# Altium project TM_DE_REV1.0.PrjPcb (part 1 of 2)
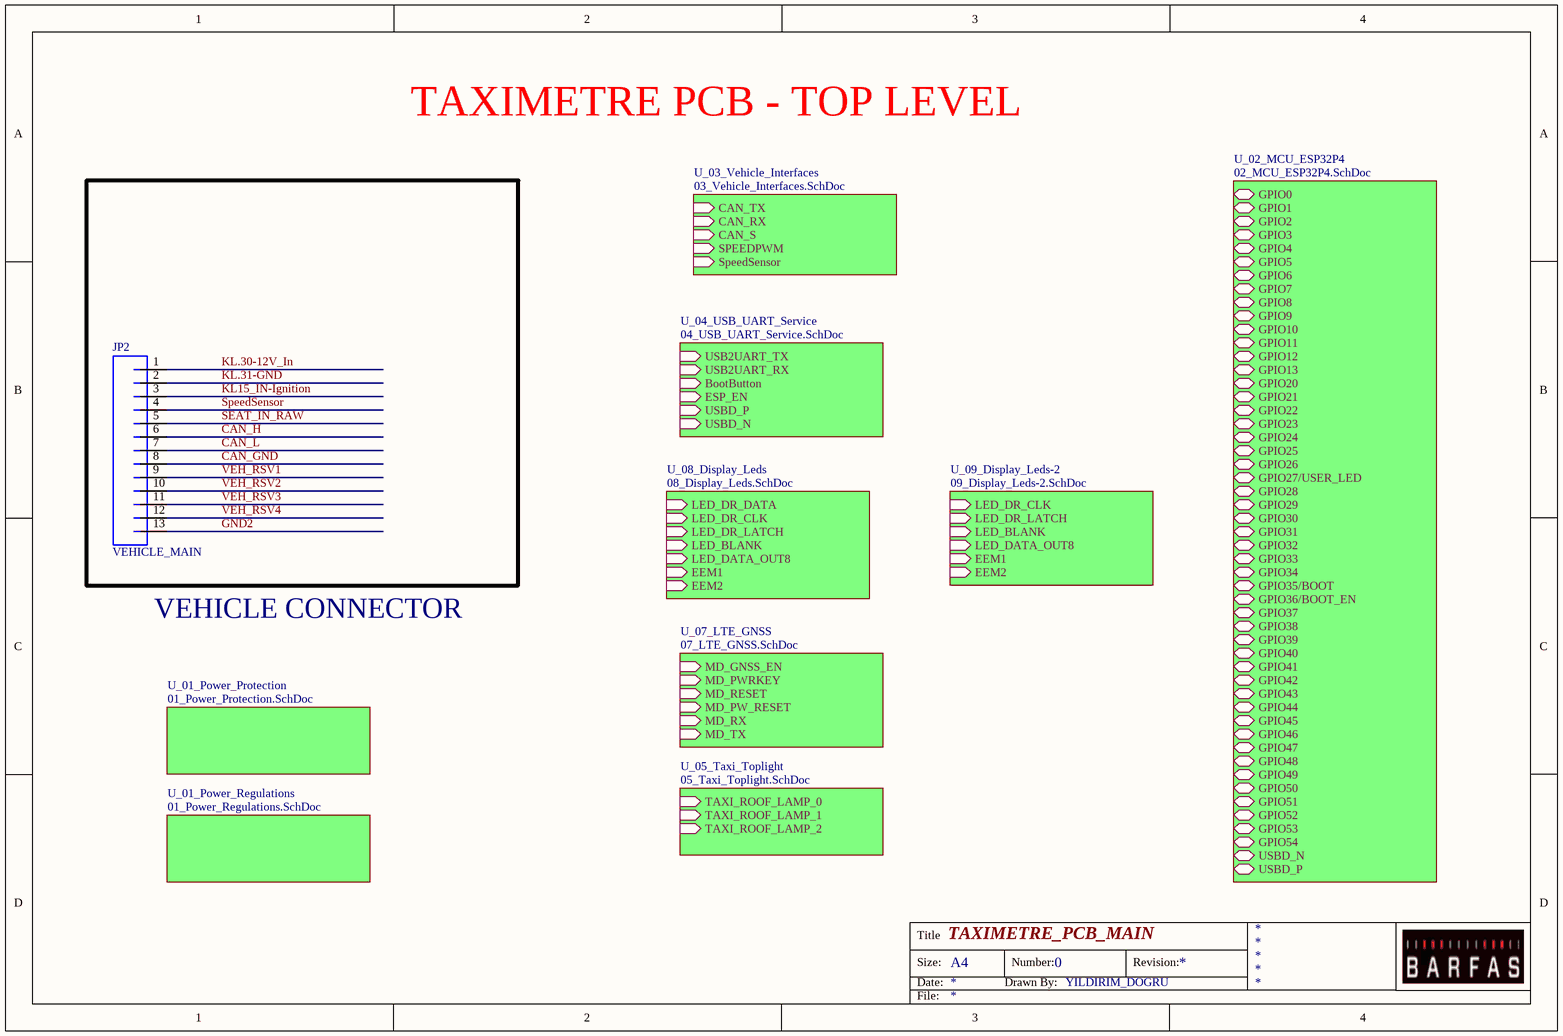
[diagram p0: TOP.SchDoc]
11 sheets, 428 parts. Net scope: hierarchical (ports join the sheet entries above them; power ports are global).
Board file: TM_DE_REV1.0.PcbDoc
Sheets:
  TOP.SchDoc
    U_08_Display_Leds = 08_Display_Leds.SchDoc
    U_09_Display_Leds-2 = 09_Display_Leds-2.SchDoc
    U_07_LTE_GNSS = 07_LTE_GNSS.SchDoc
    U_04_USB_UART_Service = 04_USB_UART_Service.SchDoc
    U_03_Vehicle_Interfaces = 03_Vehicle_Interfaces.SchDoc
    U_02_MCU_ESP32P4 = 02_MCU_ESP32P4.SchDoc
    U_01_Power_Protection = 01_Power_Protection.SchDoc
    U_01_Power_Regulations = 01_Power_Regulations.SchDoc
    U_05_Taxi_Toplight = 05_Taxi_Toplight.SchDoc
  06_RFID_RTC_Storage.SchDoc

## Sheet TOP.SchDoc: TAXIMETRE_PCB_MAIN
size A4; Author: YILDIRIM_DOGRU; CompanyName: BARFAS; DrawnBy: YILDIRIM_DOGRU; DocumentNumber: 0

### Parts
JP2  VEHICLE_MAIN  [JST-XH-13-PTH-VERT]

### Sub-sheets
U_01_Power_Protection = 01_Power_Protection.SchDoc: no entries
U_01_Power_Regulations = 01_Power_Regulations.SchDoc: no entries
U_02_MCU_ESP32P4 = 02_MCU_ESP32P4.SchDoc: GPIO0 (bidir), GPIO1 (bidir), GPIO2 (bidir), GPIO3 (bidir), GPIO4 (bidir), GPIO5 (bidir), GPIO6 (bidir), GPIO7 (bidir), GPIO8 (bidir), GPIO9 (bidir), GPIO10 (bidir), GPIO11 (bidir), GPIO12 (bidir), GPIO13 (bidir), GPIO20 (bidir), GPIO21 (bidir), GPIO22 (bidir), GPIO23 (bidir), GPIO24 (bidir), GPIO25 (bidir), GPIO26 (bidir), GPIO27/USER_LED (bidir), GPIO28 (bidir), GPIO29 (bidir), GPIO30 (bidir), GPIO31 (bidir), GPIO32 (bidir), GPIO33 (bidir), GPIO34 (bidir), GPIO35/BOOT (bidir), GPIO36/BOOT_EN (bidir), GPIO37 (bidir), GPIO38 (bidir), GPIO39 (bidir), GPIO40 (bidir), GPIO41 (bidir), GPIO42 (bidir), GPIO43 (bidir), GPIO44 (bidir), GPIO45 (bidir), GPIO46 (bidir), GPIO47 (bidir), GPIO48 (bidir), GPIO49 (bidir), GPIO50 (bidir), GPIO51 (bidir), GPIO52 (bidir), GPIO53 (bidir), GPIO54 (bidir), USBD_N (bidir), USBD_P (bidir)
U_03_Vehicle_Interfaces = 03_Vehicle_Interfaces.SchDoc: CAN_TX (in), CAN_RX (in), CAN_S (in), SPEEDPWM (in), SpeedSensor (in)
U_04_USB_UART_Service = 04_USB_UART_Service.SchDoc: USB2UART_TX (in), USB2UART_RX (in), BootButton (in), ESP_EN (in), USBD_P (in), USBD_N (in)
U_05_Taxi_Toplight = 05_Taxi_Toplight.SchDoc: TAXI_ROOF_LAMP_0 (in), TAXI_ROOF_LAMP_1 (in), TAXI_ROOF_LAMP_2 (in)
U_07_LTE_GNSS = 07_LTE_GNSS.SchDoc: MD_GNSS_EN (in), MD_PWRKEY (in), MD_RESET (in), MD_PW_RESET (in), MD_RX (in), MD_TX (in)
U_08_Display_Leds = 08_Display_Leds.SchDoc: LED_DR_DATA (in), LED_DR_CLK (in), LED_DR_LATCH (in), LED_BLANK (in), LED_DATA_OUT8 (in), EEM1 (in), EEM2 (in)
U_09_Display_Leds-2 = 09_Display_Leds-2.SchDoc: LED_DR_CLK (in), LED_DR_LATCH (in), LED_BLANK (in), LED_DATA_OUT8 (in), EEM1 (in), EEM2 (in)

### Nets
CAN_GND: JP2.8
CAN_H: JP2.6
CAN_L: JP2.7
GND2: JP2.13
KL15_IN-Ignition: JP2.3
KL.30-12V_In: JP2.1
KL.31-GND: JP2.2
SEAT_IN_RAW: JP2.5
SpeedSensor: JP2.4
VEH_RSV1: JP2.9
VEH_RSV2: JP2.10
VEH_RSV3: JP2.11
VEH_RSV4: JP2.12

### Notes on the sheet
- TAXIMETRE PCB - TOP LEVEL
- VEHICLE CONNECTOR
- Title
- Size:
- Date:
- A4
- Drawn By:
- Number:
- Revision:
- File:

### Library data of the parts
JP2 = JST_XH_13_VERT: Manufacturer: JST Sales America, Inc.; PartNumber: B13B-XH-A(LF)(SN); Mounting Technology: Through Hole; PackageReference: JST-XH

## Sheet 08_Display_Leds.SchDoc
size 558 x 431 mm
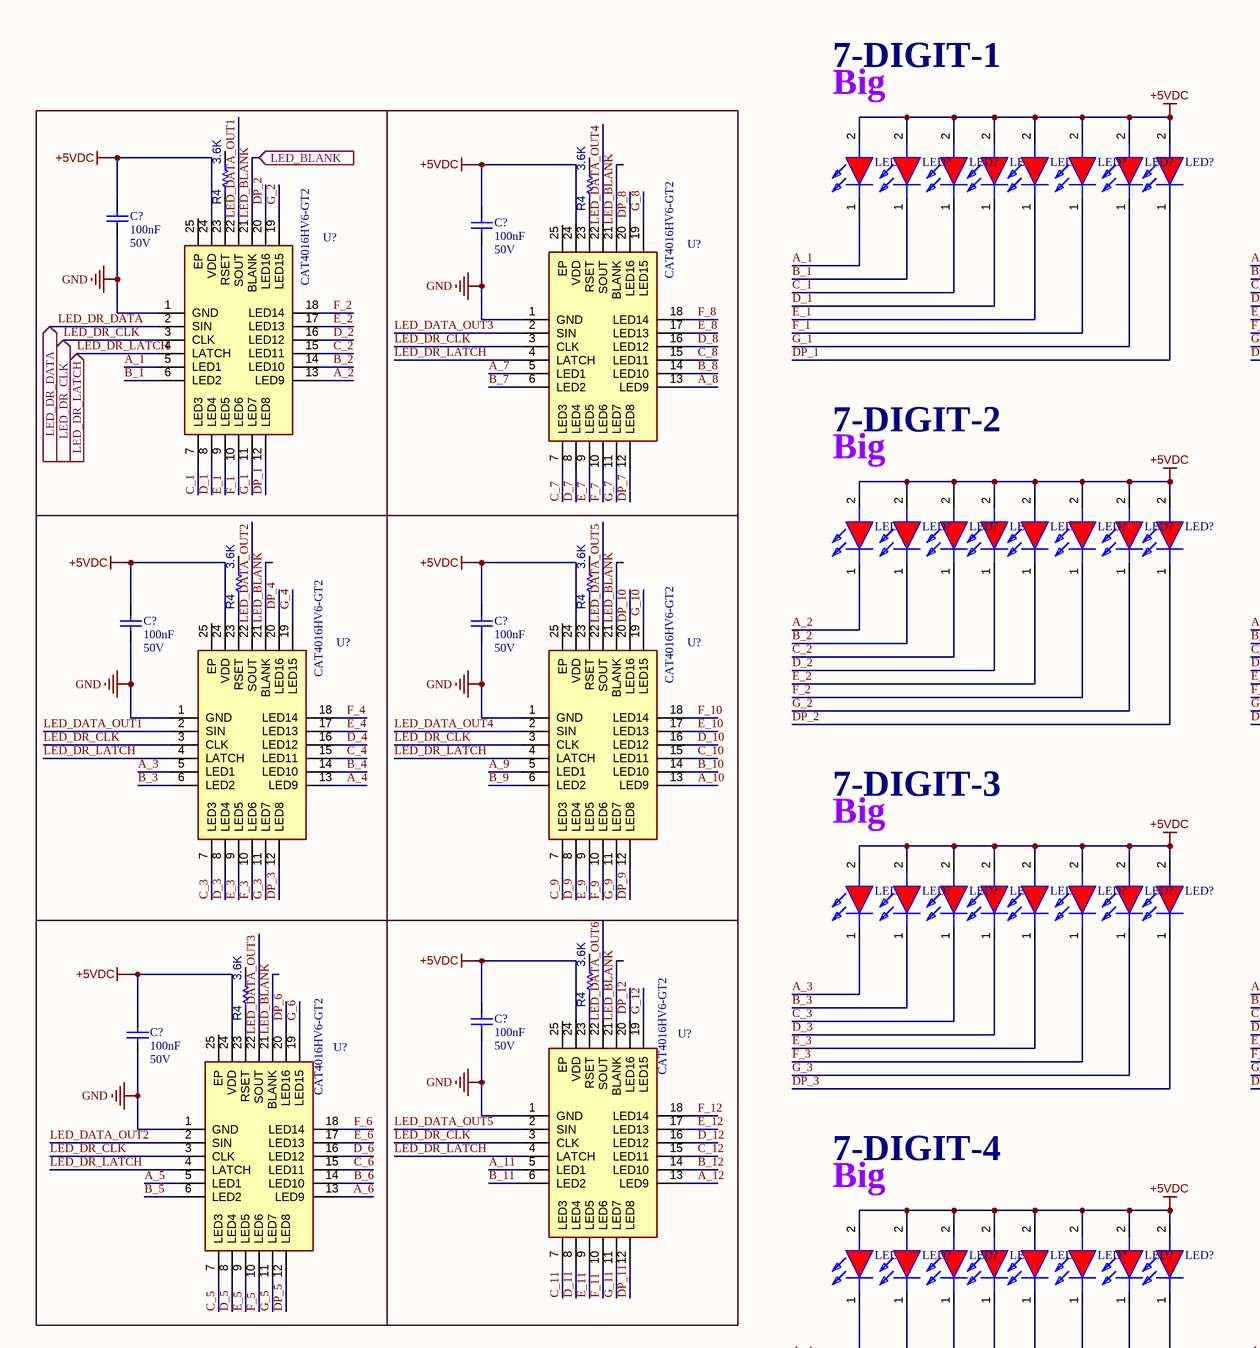
[diagram p1: 08_Display_Leds.SchDoc, top left]
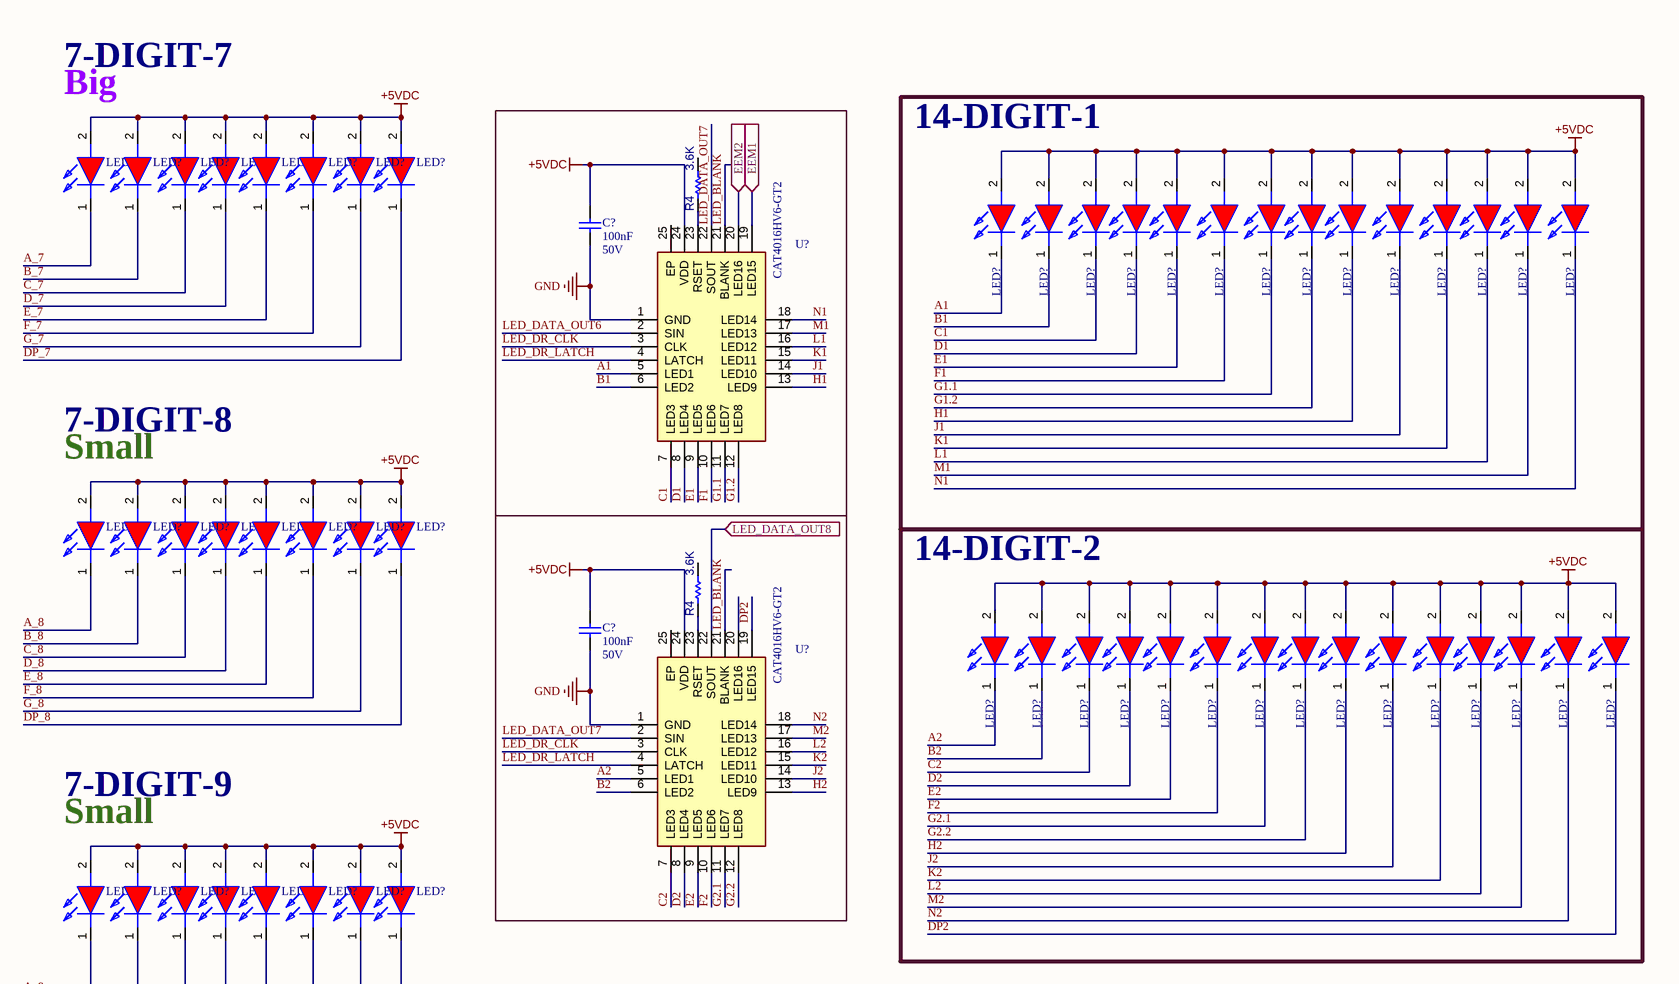
[diagram p2: 08_Display_Leds.SchDoc, top right]
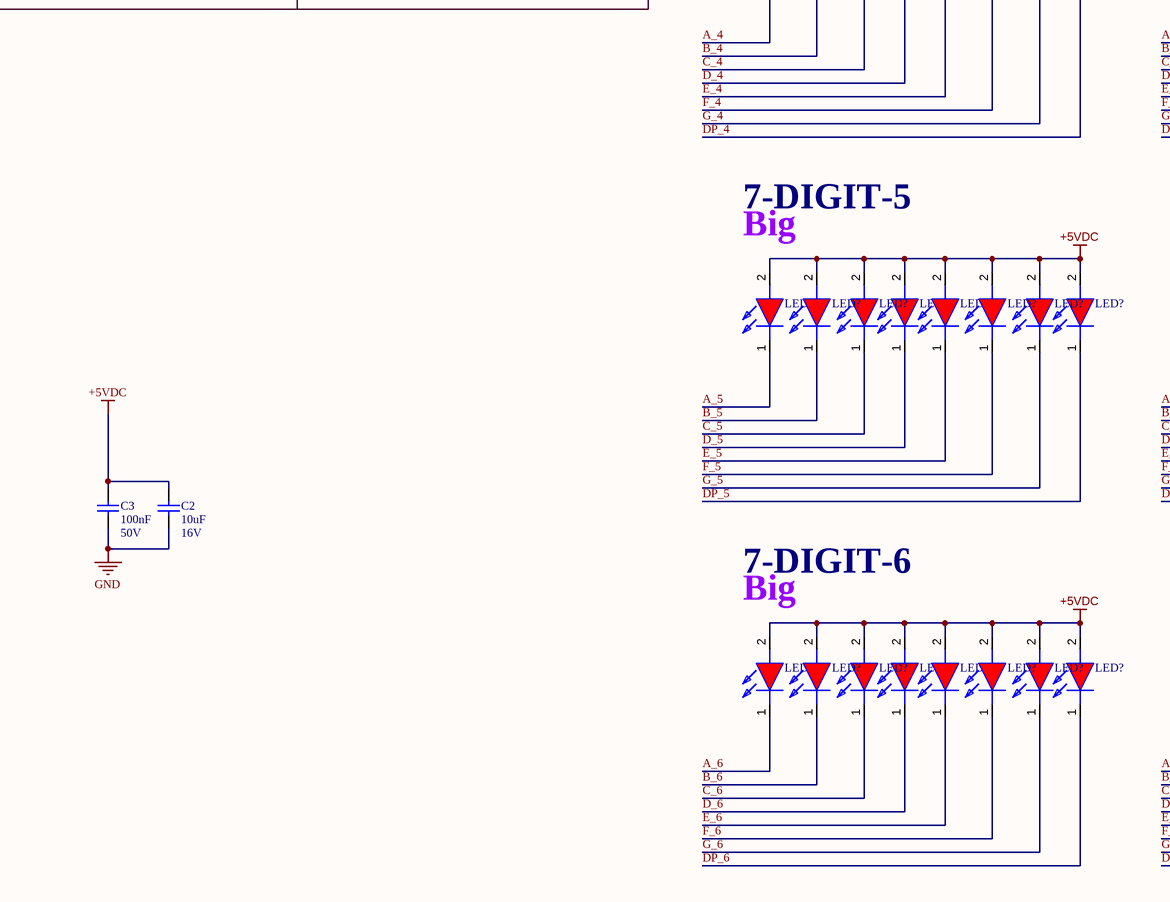
[diagram p3: 08_Display_Leds.SchDoc, bottom left]
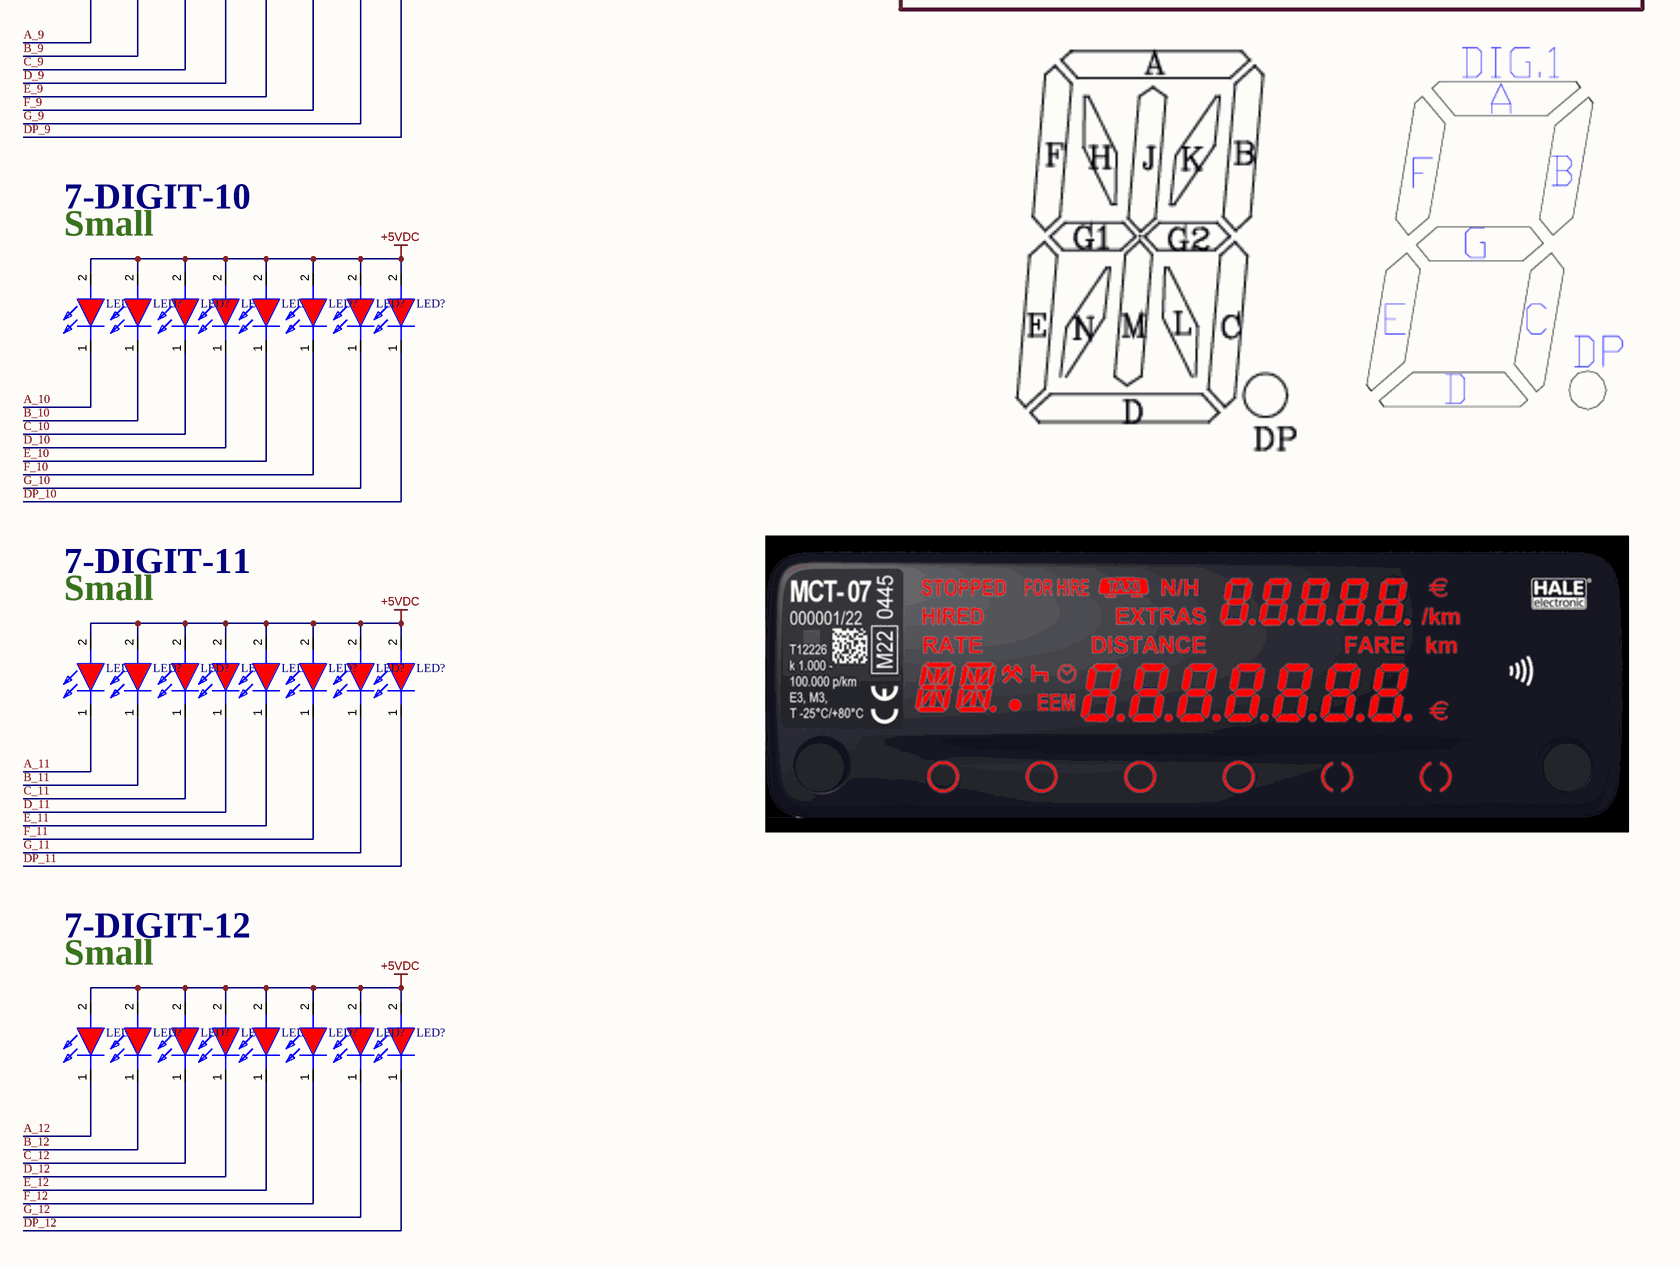
[diagram p4: 08_Display_Leds.SchDoc, bottom right]

### Parts
(Parts that share a designator on the sheet are numbered #1, #2 ... from top to bottom, then left to right.)
C2#1  value 10uF  Voltage: 16V  [CAP_0805]  (hidden comment: CAP)
C3#1  value 100nF  Voltage: 50V  [CAP_0603]  (hidden comment: CAP)
C?#1  value 100nF  Voltage: 50V  [CAP_0603]  (hidden comment: CAP)
C?#2  value 100nF  Voltage: 50V  [CAP_0603]  (hidden comment: CAP)
C?#3  value 100nF  Voltage: 50V  [CAP_0603]  (hidden comment: CAP)
C?#4  value 100nF  Voltage: 50V  [CAP_0603]  (hidden comment: CAP)
C?#5  value 100nF  Voltage: 50V  [CAP_0603]  (hidden comment: CAP)
C?#6  value 100nF  Voltage: 50V  [CAP_0603]  (hidden comment: CAP)
C?#7  value 100nF  Voltage: 50V  [CAP_0603]  (hidden comment: CAP)
C?#8  value 100nF  Voltage: 50V  [CAP_0603]  (hidden comment: CAP)
LED?#1  YLED0402R  [APHHS1005LSECKJ3PF]  (value not drawn)
LED?#2  YLED0402R  [APHHS1005LSECKJ3PF]  (value not drawn)
LED?#3  YLED0402R  [APHHS1005LSECKJ3PF]  (value not drawn)
LED?#4  YLED0402R  [APHHS1005LSECKJ3PF]  (value not drawn)
LED?#5  YLED0402R  [APHHS1005LSECKJ3PF]  (value not drawn)
LED?#6  YLED0402R  [APHHS1005LSECKJ3PF]  (value not drawn)
LED?#7  YLED0402R  [APHHS1005LSECKJ3PF]  (value not drawn)
LED?#8  YLED0402R  [APHHS1005LSECKJ3PF]  (value not drawn)
LED?#9  YLED0402R  [APHHS1005LSECKJ3PF]  (value not drawn)
LED?#10  YLED0402R  [APHHS1005LSECKJ3PF]  (value not drawn)
LED?#11  YLED0402R  [APHHS1005LSECKJ3PF]  (value not drawn)
LED?#12  YLED0402R  [APHHS1005LSECKJ3PF]  (value not drawn)
LED?#13  YLED0402R  [APHHS1005LSECKJ3PF]  (value not drawn)
LED?#14  YLED0402R  [APHHS1005LSECKJ3PF]  (value not drawn)
LED?#15  YLED0402R  [APHHS1005LSECKJ3PF]  (value not drawn)
LED?#16  YLED0402R  [APHHS1005LSECKJ3PF]  (value not drawn)
LED?#17  YLED0402R  [APHHS1005LSECKJ3PF]  (value not drawn)
LED?#18  YLED0402R  [APHHS1005LSECKJ3PF]  (value not drawn)
LED?#19  YLED0402R  [APHHS1005LSECKJ3PF]  (value not drawn)
LED?#20  YLED0402R  [APHHS1005LSECKJ3PF]  (value not drawn)
LED?#21  YLED0402R  [APHHS1005LSECKJ3PF]  (value not drawn)
LED?#22  YLED0402R  [APHHS1005LSECKJ3PF]  (value not drawn)
LED?#23  YLED0402R  [APHHS1005LSECKJ3PF]  (value not drawn)
LED?#24  YLED0402R  [APHHS1005LSECKJ3PF]  (value not drawn)
LED?#25  YLED0402R  [APHHS1005LSECKJ3PF]  (value not drawn)
LED?#26  YLED0402R  [APHHS1005LSECKJ3PF]  (value not drawn)
LED?#27  YLED0402R  [APHHS1005LSECKJ3PF]  (value not drawn)
LED?#28  YLED0402R  [APHHS1005LSECKJ3PF]  (value not drawn)
LED?#29  YLED0402R  [APHHS1005LSECKJ3PF]  (value not drawn)
LED?#30  YLED0402R  [APHHS1005LSECKJ3PF]  (value not drawn)
LED?#31  YLED0402R  [APHHS1005LSECKJ3PF]  (value not drawn)
LED?#32  YLED0402R  [APHHS1005LSECKJ3PF]  (value not drawn)
LED?#33  YLED0402R  [APHHS1005LSECKJ3PF]  (value not drawn)
LED?#34  YLED0402R  [APHHS1005LSECKJ3PF]  (value not drawn)
LED?#35  YLED0402R  [APHHS1005LSECKJ3PF]  (value not drawn)
LED?#36  YLED0402R  [APHHS1005LSECKJ3PF]  (value not drawn)
LED?#37  YLED0402R  [APHHS1005LSECKJ3PF]  (value not drawn)
LED?#38  YLED0402R  [APHHS1005LSECKJ3PF]  (value not drawn)
LED?#39  YLED0402R  [APHHS1005LSECKJ3PF]  (value not drawn)
LED?#40  YLED0402R  [APHHS1005LSECKJ3PF]  (value not drawn)
LED?#41  YLED0402R  [APHHS1005LSECKJ3PF]  (value not drawn)
LED?#42  YLED0402R  [APHHS1005LSECKJ3PF]  (value not drawn)
LED?#43  YLED0402R  [APHHS1005LSECKJ3PF]  (value not drawn)
LED?#44  YLED0402R  [APHHS1005LSECKJ3PF]  (value not drawn)
LED?#45  YLED0402R  [APHHS1005LSECKJ3PF]  (value not drawn)
LED?#46  YLED0402R  [APHHS1005LSECKJ3PF]  (value not drawn)
LED?#47  YLED0402R  [APHHS1005LSECKJ3PF]  (value not drawn)
LED?#48  YLED0402R  [APHHS1005LSECKJ3PF]  (value not drawn)
LED?#49  YLED0402R  [APHHS1005LSECKJ3PF]  (value not drawn)
LED?#50  YLED0402R  [APHHS1005LSECKJ3PF]  (value not drawn)
LED?#51  YLED0402R  [APHHS1005LSECKJ3PF]  (value not drawn)
LED?#52  YLED0402R  [APHHS1005LSECKJ3PF]  (value not drawn)
LED?#53  YLED0402R  [APHHS1005LSECKJ3PF]  (value not drawn)
LED?#54  YLED0402R  [APHHS1005LSECKJ3PF]  (value not drawn)
LED?#55  YLED0402R  [APHHS1005LSECKJ3PF]  (value not drawn)
LED?#56  YLED0402R  [APHHS1005LSECKJ3PF]  (value not drawn)
LED?#57  YLED0402R  [APHHS1005LSECKJ3PF]  (value not drawn)
LED?#58  YLED0402R  [APHHS1005LSECKJ3PF]  (value not drawn)
LED?#59  YLED0402R  [APHHS1005LSECKJ3PF]  (value not drawn)
LED?#60  YLED0402R  [APHHS1005LSECKJ3PF]  (value not drawn)
LED?#61  YLED0402R  [APHHS1005LSECKJ3PF]  (value not drawn)
LED?#62  YLED0402R  [APHHS1005LSECKJ3PF]  (value not drawn)
LED?#63  YLED0402R  [APHHS1005LSECKJ3PF]  (value not drawn)
LED?#64  YLED0402R  [APHHS1005LSECKJ3PF]  (value not drawn)
LED?#65  YLED0402R  [APHHS1005LSECKJ3PF]  (value not drawn)
LED?#66  YLED0402R  [APHHS1005LSECKJ3PF]  (value not drawn)
LED?#67  YLED0402R  [APHHS1005LSECKJ3PF]  (value not drawn)
LED?#68  YLED0402R  [APHHS1005LSECKJ3PF]  (value not drawn)
LED?#69  YLED0402R  [APHHS1005LSECKJ3PF]  (value not drawn)
LED?#70  YLED0402R  [APHHS1005LSECKJ3PF]  (value not drawn)
LED?#71  YLED0402R  [APHHS1005LSECKJ3PF]  (value not drawn)
LED?#72  YLED0402R  [APHHS1005LSECKJ3PF]  (value not drawn)
LED?#73  YLED0402R  [APHHS1005LSECKJ3PF]  (value not drawn)
LED?#74  YLED0402R  [APHHS1005LSECKJ3PF]  (value not drawn)
LED?#75  YLED0402R  [APHHS1005LSECKJ3PF]  (value not drawn)
LED?#76  YLED0402R  [APHHS1005LSECKJ3PF]  (value not drawn)
LED?#77  YLED0402R  [APHHS1005LSECKJ3PF]  (value not drawn)
LED?#78  YLED0402R  [APHHS1005LSECKJ3PF]  (value not drawn)
LED?#79  YLED0402R  [APHHS1005LSECKJ3PF]  (value not drawn)
LED?#80  YLED0402R  [APHHS1005LSECKJ3PF]  (value not drawn)
LED?#81  YLED0402R  [APHHS1005LSECKJ3PF]  (value not drawn)
LED?#82  YLED0402R  [APHHS1005LSECKJ3PF]  (value not drawn)
LED?#83  YLED0402R  [APHHS1005LSECKJ3PF]  (value not drawn)
LED?#84  YLED0402R  [APHHS1005LSECKJ3PF]  (value not drawn)
LED?#85  YLED0402R  [APHHS1005LSECKJ3PF]  (value not drawn)
LED?#86  YLED0402R  [APHHS1005LSECKJ3PF]  (value not drawn)
LED?#87  YLED0402R  [APHHS1005LSECKJ3PF]  (value not drawn)
LED?#88  YLED0402R  [APHHS1005LSECKJ3PF]  (value not drawn)
LED?#89  YLED0402R  [APHHS1005LSECKJ3PF]  (value not drawn)
LED?#90  YLED0402R  [APHHS1005LSECKJ3PF]  (value not drawn)
LED?#91  YLED0402R  [APHHS1005LSECKJ3PF]  (value not drawn)
LED?#92  YLED0402R  [APHHS1005LSECKJ3PF]  (value not drawn)
LED?#93  YLED0402R  [APHHS1005LSECKJ3PF]  (value not drawn)
LED?#94  YLED0402R  [APHHS1005LSECKJ3PF]  (value not drawn)
LED?#95  YLED0402R  [APHHS1005LSECKJ3PF]  (value not drawn)
LED?#96  YLED0402R  [APHHS1005LSECKJ3PF]  (value not drawn)
LED?#97  YLED0402R  [APHHS1005LSECKJ3PF]  (value not drawn)
LED?#98  YLED0402R  [APHHS1005LSECKJ3PF]  (value not drawn)
LED?#99  YLED0402R  [APHHS1005LSECKJ3PF]  (value not drawn)
LED?#100  YLED0402R  [APHHS1005LSECKJ3PF]  (value not drawn)
LED?#101  YLED0402R  [APHHS1005LSECKJ3PF]  (value not drawn)
LED?#102  YLED0402R  [APHHS1005LSECKJ3PF]  (value not drawn)
LED?#103  YLED0402R  [APHHS1005LSECKJ3PF]  (value not drawn)
LED?#104  YLED0402R  [APHHS1005LSECKJ3PF]  (value not drawn)
LED?#105  YLED0402R  [APHHS1005LSECKJ3PF]  (value not drawn)
LED?#106  YLED0402R  [APHHS1005LSECKJ3PF]  (value not drawn)
LED?#107  YLED0402R  [APHHS1005LSECKJ3PF]  (value not drawn)
LED?#108  YLED0402R  [APHHS1005LSECKJ3PF]  (value not drawn)
LED?#109  YLED0402R  [APHHS1005LSECKJ3PF]  (value not drawn)
LED?#110  YLED0402R  [APHHS1005LSECKJ3PF]  (value not drawn)
LED?#111  YLED0402R  [APHHS1005LSECKJ3PF]  (value not drawn)
LED?#112  YLED0402R  [APHHS1005LSECKJ3PF]  (value not drawn)
LED?#113  YLED0402R  [APHHS1005LSECKJ3PF]  (value not drawn)
LED?#114  YLED0402R  [APHHS1005LSECKJ3PF]  (value not drawn)
LED?#115  YLED0402R  [APHHS1005LSECKJ3PF]  (value not drawn)
LED?#116  YLED0402R  [APHHS1005LSECKJ3PF]  (value not drawn)
LED?#117  YLED0402R  [APHHS1005LSECKJ3PF]  (value not drawn)
LED?#118  YLED0402R  [APHHS1005LSECKJ3PF]  (value not drawn)
LED?#119  YLED0402R  [APHHS1005LSECKJ3PF]  (value not drawn)
LED?#120  YLED0402R  [APHHS1005LSECKJ3PF]  (value not drawn)
LED?#121  YLED0402R  [APHHS1005LSECKJ3PF]  (value not drawn)
LED?#122  YLED0402R  [APHHS1005LSECKJ3PF]  (value not drawn)
LED?#123  YLED0402R  [APHHS1005LSECKJ3PF]  (value not drawn)
LED?#124  YLED0402R  [APHHS1005LSECKJ3PF]  (value not drawn)
LED?#125  YLED0402R  [APHHS1005LSECKJ3PF]  (value not drawn)
R4#1  value 3.6K  [RES_0603]  (hidden comment: RC0603FR-133K6L)
R4#2  value 3.6K  [RES_0603]  (hidden comment: RC0603FR-133K6L)
R4#3  value 3.6K  [RES_0603]  (hidden comment: RC0603FR-133K6L)
R4#4  value 3.6K  [RES_0603]  (hidden comment: RC0603FR-133K6L)
R4#5  value 3.6K  [RES_0603]  (hidden comment: RC0603FR-133K6L)
R4#6  value 3.6K  [RES_0603]  (hidden comment: RC0603FR-133K6L)
R4#7  value 3.6K  [RES_0603]  (hidden comment: RC0603FR-133K6L)
R4#8  value 3.6K  [RES_0603]  (hidden comment: RC0603FR-133K6L)
U?#1  CAT4016HV6-GT2  [QFN50P400X400X80-25N-D]
U?#2  CAT4016HV6-GT2  [QFN50P400X400X80-25N-D]
U?#3  CAT4016HV6-GT2  [QFN50P400X400X80-25N-D]
U?#4  CAT4016HV6-GT2  [QFN50P400X400X80-25N-D]
U?#5  CAT4016HV6-GT2  [QFN50P400X400X80-25N-D]
U?#6  CAT4016HV6-GT2  [QFN50P400X400X80-25N-D]
U?#7  CAT4016HV6-GT2  [QFN50P400X400X80-25N-D]
U?#8  CAT4016HV6-GT2  [QFN50P400X400X80-25N-D]

### Blocks framed on the sheet
14-DIGIT-1: LED?#17-LED?#30
14-DIGIT-2: LED?#47-LED?#61

### Ports
EEM1 (in), EEM2 (in), LED_BLANK (in), LED_DATA_OUT8 (in), LED_DR_CLK (in), LED_DR_DATA (in), LED_DR_LATCH (in)

### Nets
+5VDC: C2#1.1 C3#1.1 C?#1.1 C?#2.1 C?#3.1 C?#4.1 C?#5.1 C?#6.1 C?#7.1 C?#8.1 LED?#1.2(A) LED?#2.2(A) LED?#3.2(A) LED?#4.2(A) LED?#5.2(A) LED?#6.2(A) LED?#7.2(A) LED?#8.2(A) LED?#9.2(A) LED?#10.2(A) LED?#11.2(A) LED?#12.2(A) LED?#13.2(A) LED?#14.2(A) LED?#15.2(A) LED?#16.2(A) LED?#17.2(A) LED?#18.2(A) LED?#19.2(A) LED?#20.2(A) LED?#21.2(A) LED?#22.2(A) LED?#23.2(A) LED?#24.2(A) LED?#25.2(A) LED?#26.2(A) LED?#27.2(A) LED?#28.2(A) LED?#29.2(A) LED?#30.2(A) LED?#31.2(A) LED?#32.2(A) LED?#33.2(A) LED?#34.2(A) LED?#35.2(A) LED?#36.2(A) LED?#37.2(A) LED?#38.2(A) LED?#39.2(A) LED?#40.2(A) LED?#41.2(A) LED?#42.2(A) LED?#43.2(A) LED?#44.2(A) LED?#45.2(A) LED?#46.2(A) LED?#47.2(A) LED?#48.2(A) LED?#49.2(A) LED?#50.2(A) LED?#51.2(A) LED?#52.2(A) LED?#53.2(A) LED?#54.2(A) LED?#55.2(A) LED?#56.2(A) LED?#57.2(A) LED?#58.2(A) LED?#59.2(A) LED?#60.2(A) LED?#61.2(A) LED?#62.2(A) LED?#63.2(A) LED?#64.2(A) LED?#65.2(A) LED?#66.2(A) LED?#67.2(A) LED?#68.2(A) LED?#69.2(A) LED?#70.2(A) LED?#71.2(A) LED?#72.2(A) LED?#73.2(A) LED?#74.2(A) LED?#75.2(A) LED?#76.2(A) LED?#77.2(A) LED?#78.2(A) LED?#79.2(A) LED?#80.2(A) LED?#81.2(A) LED?#82.2(A) LED?#83.2(A) LED?#84.2(A) LED?#85.2(A) LED?#86.2(A) LED?#87.2(A) LED?#88.2(A) LED?#89.2(A) LED?#90.2(A) LED?#91.2(A) LED?#92.2(A) LED?#93.2(A) LED?#94.2(A) LED?#95.2(A) LED?#96.2(A) LED?#97.2(A) LED?#98.2(A) LED?#99.2(A) LED?#100.2(A) LED?#101.2(A) LED?#102.2(A) LED?#103.2(A) LED?#104.2(A) LED?#105.2(A) LED?#106.2(A) LED?#107.2(A) LED?#108.2(A) LED?#109.2(A) LED?#110.2(A) LED?#111.2(A) LED?#112.2(A) LED?#113.2(A) LED?#114.2(A) LED?#115.2(A) LED?#116.2(A) LED?#117.2(A) LED?#118.2(A) LED?#119.2(A) LED?#120.2(A) LED?#121.2(A) LED?#122.2(A) LED?#123.2(A) LED?#124.2(A) LED?#125.2(A) U?#1.24(VDD) U?#2.24(VDD) U?#3.24(VDD) U?#4.24(VDD) U?#5.24(VDD) U?#6.24(VDD) U?#7.24(VDD) U?#8.24(VDD)
GND: C2#1.2 C3#1.2 C?#1.2 C?#2.2 C?#3.2 C?#4.2 C?#5.2 C?#6.2 C?#7.2 C?#8.2 U?#1.1(GND) U?#2.1(GND) U?#3.1(GND) U?#4.1(GND) U?#5.1(GND) U?#6.1(GND) U?#7.1(GND) U?#8.1(GND)  [project net TVSS]
A1: LED?#17.1(K) U?#3.5(LED1)
A2: LED?#47.1(K) U?#6.5(LED1)
A_1: LED?#1.1(K) U?#1.5(LED1)
A_2: LED?#31.1(K) U?#1.13(LED9)
A_3: LED?#62.1(K) U?#4.5(LED1)
A_4: LED?#78.1(K) U?#4.13(LED9)
A_5: LED?#94.1(K) U?#8.5(LED1)
A_6: LED?#110.1(K) U?#8.13(LED9)
A_7: LED?#9.1(K) U?#2.5(LED1)
A_8: LED?#39.1(K) U?#2.13(LED9)
A_9: LED?#70.1(K) U?#5.5(LED1)
A_10: LED?#86.1(K) U?#5.13(LED9)
A_11: LED?#102.1(K) U?#7.5(LED1)
A_12: LED?#118.1(K) U?#7.13(LED9)
B1: LED?#18.1(K) U?#3.6(LED2)
B2: LED?#48.1(K) U?#6.6(LED2)
B_1: LED?#2.1(K) U?#1.6(LED2)
B_2: LED?#32.1(K) U?#1.14(LED10)
B_3: LED?#63.1(K) U?#4.6(LED2)
B_4: LED?#79.1(K) U?#4.14(LED10)
B_5: LED?#95.1(K) U?#8.6(LED2)
B_6: LED?#111.1(K) U?#8.14(LED10)
B_7: LED?#10.1(K) U?#2.6(LED2)
B_8: LED?#40.1(K) U?#2.14(LED10)
B_9: LED?#71.1(K) U?#5.6(LED2)
B_10: LED?#87.1(K) U?#5.14(LED10)
B_11: LED?#103.1(K) U?#7.6(LED2)
B_12: LED?#119.1(K) U?#7.14(LED10)
C1: LED?#19.1(K) U?#3.7(LED3)
C2: LED?#49.1(K) U?#6.7(LED3)
C_1: LED?#3.1(K) U?#1.7(LED3)
C_2: LED?#33.1(K) U?#1.15(LED11)
C_3: LED?#64.1(K) U?#4.7(LED3)
C_4: LED?#80.1(K) U?#4.15(LED11)
C_5: LED?#96.1(K) U?#8.7(LED3)
C_6: LED?#112.1(K) U?#8.15(LED11)
C_7: LED?#11.1(K) U?#2.7(LED3)
C_8: LED?#41.1(K) U?#2.15(LED11)
C_9: LED?#72.1(K) U?#5.7(LED3)
C_10: LED?#88.1(K) U?#5.15(LED11)
C_11: LED?#104.1(K) U?#7.7(LED3)
C_12: LED?#120.1(K) U?#7.15(LED11)
D1: LED?#20.1(K) U?#3.8(LED4)
D2: LED?#50.1(K) U?#6.8(LED4)
D_1: LED?#4.1(K) U?#1.8(LED4)
D_2: LED?#34.1(K) U?#1.16(LED12)
D_3: LED?#65.1(K) U?#4.8(LED4)
D_4: LED?#81.1(K) U?#4.16(LED12)
D_5: LED?#97.1(K) U?#8.8(LED4)
D_6: LED?#113.1(K) U?#8.16(LED12)
D_7: LED?#12.1(K) U?#2.8(LED4)
D_8: LED?#42.1(K) U?#2.16(LED12)
D_9: LED?#73.1(K) U?#5.8(LED4)
D_10: LED?#89.1(K) U?#5.16(LED12)
D_11: LED?#105.1(K) U?#7.8(LED4)
D_12: LED?#121.1(K) U?#7.16(LED12)
DP2: LED?#61.1(K) U?#6.19(LED15)
DP_1: LED?#8.1(K) U?#1.12(LED8)
DP_2: LED?#38.1(K) U?#1.20(LED16)
DP_3: LED?#69.1(K) U?#4.12(LED8)
DP_4: LED?#85.1(K) U?#4.20(LED16)
DP_5: LED?#101.1(K) U?#8.12(LED8)
DP_6: LED?#117.1(K) U?#8.20(LED16)
DP_7: LED?#16.1(K) U?#2.12(LED8)
DP_8: LED?#46.1(K) U?#2.20(LED16)
DP_9: LED?#77.1(K) U?#5.12(LED8)
DP_10: LED?#93.1(K) U?#5.20(LED16)
DP_11: LED?#109.1(K) U?#7.12(LED8)
DP_12: LED?#125.1(K) U?#7.20(LED16)
E1: LED?#21.1(K) U?#3.9(LED5)
E2: LED?#51.1(K) U?#6.9(LED5)
E_1: LED?#5.1(K) U?#1.9(LED5)
E_2: LED?#35.1(K) U?#1.17(LED13)
E_3: LED?#66.1(K) U?#4.9(LED5)
E_4: LED?#82.1(K) U?#4.17(LED13)
E_5: LED?#98.1(K) U?#8.9(LED5)
E_6: LED?#114.1(K) U?#8.17(LED13)
E_7: LED?#13.1(K) U?#2.9(LED5)
E_8: LED?#43.1(K) U?#2.17(LED13)
E_9: LED?#74.1(K) U?#5.9(LED5)
E_10: LED?#90.1(K) U?#5.17(LED13)
E_11: LED?#106.1(K) U?#7.9(LED5)
E_12: LED?#122.1(K) U?#7.17(LED13)
F1: LED?#22.1(K) U?#3.10(LED6)
F2: LED?#52.1(K) U?#6.10(LED6)
F_1: LED?#6.1(K) U?#1.10(LED6)
F_2: LED?#36.1(K) U?#1.18(LED14)
F_3: LED?#67.1(K) U?#4.10(LED6)
F_4: LED?#83.1(K) U?#4.18(LED14)
F_5: LED?#99.1(K) U?#8.10(LED6)
F_6: LED?#115.1(K) U?#8.18(LED14)
F_7: LED?#14.1(K) U?#2.10(LED6)
F_8: LED?#44.1(K) U?#2.18(LED14)
F_9: LED?#75.1(K) U?#5.10(LED6)
F_10: LED?#91.1(K) U?#5.18(LED14)
F_11: LED?#107.1(K) U?#7.10(LED6)
F_12: LED?#123.1(K) U?#7.18(LED14)
G1.1: LED?#23.1(K) U?#3.11(LED7)
G1.2: LED?#24.1(K) U?#3.12(LED8)
G2.1: LED?#53.1(K) U?#6.11(LED7)
G2.2: LED?#54.1(K) U?#6.12(LED8)
G_1: LED?#7.1(K) U?#1.11(LED7)
G_2: LED?#37.1(K) U?#1.19(LED15)
G_3: LED?#68.1(K) U?#4.11(LED7)
G_4: LED?#84.1(K) U?#4.19(LED15)
G_5: LED?#100.1(K) U?#8.11(LED7)
G_6: LED?#116.1(K) U?#8.19(LED15)
G_7: LED?#15.1(K) U?#2.11(LED7)
G_8: LED?#45.1(K) U?#2.19(LED15)
G_9: LED?#76.1(K) U?#5.11(LED7)
G_10: LED?#92.1(K) U?#5.19(LED15)
G_11: LED?#108.1(K) U?#7.11(LED7)
G_12: LED?#124.1(K) U?#7.19(LED15)
H1: LED?#25.1(K) U?#3.13(LED9)
H2: LED?#55.1(K) U?#6.13(LED9)
J1: LED?#26.1(K) U?#3.14(LED10)
J2: LED?#56.1(K) U?#6.14(LED10)
K1: LED?#27.1(K) U?#3.15(LED11)
K2: LED?#57.1(K) U?#6.15(LED11)
L1: LED?#28.1(K) U?#3.16(LED12)
L2: LED?#58.1(K) U?#6.16(LED12)
LED_BLANK: U?#1.21(BLANK) U?#2.21(BLANK) U?#3.21(BLANK) U?#4.21(BLANK) U?#5.21(BLANK) U?#6.21(BLANK) U?#7.21(BLANK) U?#8.21(BLANK) ; port LED_BLANK
LED_DATA_OUT1: U?#1.22(SOUT) U?#4.2(SIN)
LED_DATA_OUT2: U?#4.22(SOUT) U?#8.2(SIN)
LED_DATA_OUT3: U?#2.2(SIN) U?#8.22(SOUT)
LED_DATA_OUT4: U?#2.22(SOUT) U?#5.2(SIN)
LED_DATA_OUT5: U?#5.22(SOUT) U?#7.2(SIN)
LED_DATA_OUT6: U?#3.2(SIN) U?#7.22(SOUT)
LED_DATA_OUT7: U?#3.22(SOUT) U?#6.2(SIN)
LED_DR_CLK: U?#1.3(CLK) U?#2.3(CLK) U?#3.3(CLK) U?#4.3(CLK) U?#5.3(CLK) U?#6.3(CLK) U?#7.3(CLK) U?#8.3(CLK) ; port LED_DR_CLK
LED_DR_DATA: U?#1.2(SIN) ; port LED_DR_DATA
LED_DR_LATCH: U?#1.4(LATCH) U?#2.4(LATCH) U?#3.4(LATCH) U?#4.4(LATCH) U?#5.4(LATCH) U?#6.4(LATCH) U?#7.4(LATCH) U?#8.4(LATCH) ; port LED_DR_LATCH
M1: LED?#29.1(K) U?#3.17(LED13)
M2: LED?#59.1(K) U?#6.17(LED13)
N1: LED?#30.1(K) U?#3.18(LED14)
N2: LED?#60.1(K) U?#6.18(LED14)
NetR4#1_1: R4#1.1 U?#1.23(RSET)
NetR4#2_1: R4#2.1 U?#2.23(RSET)
NetR4#3_1: R4#3.1 U?#3.23(RSET)
NetR4#4_1: R4#4.1 U?#4.23(RSET)
NetR4#5_1: R4#5.1 U?#5.23(RSET)
NetR4#6_1: R4#6.1 U?#6.23(RSET)
NetR4#7_1: R4#7.1 U?#7.23(RSET)
NetR4#8_1: R4#8.1 U?#8.23(RSET)
NetU?#3_19: U?#3.19(LED15) ; port EEM1
NetU?#3_20: U?#3.20(LED16) ; port EEM2
NetU?#6_22: U?#6.22(SOUT) ; port LED_DATA_OUT8

Not connected (* = marked no-connect by the designer): R4#1 2; R4#2 2; R4#3 2; R4#4 2; R4#5 2; R4#6 2; R4#7 2; R4#8 2; U?#1 25(EP); U?#2 25(EP); U?#3 25(EP); U?#4 25(EP); U?#5 25(EP); U?#6 20(LED16) 25(EP); U?#7 25(EP); U?#8 25(EP)

### Notes on the sheet
- 7-DIGIT-1
- (near LED?#1) Big
- 7-DIGIT-7
- (near LED?#9) Big
- 7-DIGIT-2
- (near LED?#31) Big
- 7-DIGIT-8
- (near LED?#39) Small
- 7-DIGIT-3
- 7-DIGIT-9
- (near LED?#62) Big
- (near LED?#70) Small
- 7-DIGIT-4
- (near LED?#78) Big
- 7-DIGIT-10
- (near LED?#86) Small
- 7-DIGIT-5
- 7-DIGIT-11
- (near LED?#94) Big
- (near LED?#102) Small
- 7-DIGIT-6
- 7-DIGIT-12
- (near LED?#110) Big
- (near LED?#118) Small
- DWG. NO.
- REV.
- SHT.
- REVISION
- DESCRIPTION
- DATE
- APPROVED
- THIS DOCUMENT AND THE DATA DISCLOSED HEREIN OR HEREWITH IS THE PROPERTY OF ALTIUM LIMITED AND MAY BE FREELY DISTRIBUTED IN WHOLE. NO RIGHTS ARE RESERVED OR EXPRESS OR IMPLIED WARANTEE GIVEN.
- ENG:
- DSN:
- APPROVALS
- PROJECT
- DOCUMENT REVISION:
- DESIGN ITEM:
- CHK:
- BOM:
- REFERENCE DOCUMENTS
- PROJECT REVISION:
- TITLE
- FAB DWG:
- PCB DWG:
- ASSY DWG:
- SCALE:
- SIZE
- C
- CAGE CODE
- FILE NAME
- DWG NO.
- SHEET
- OF
- REV

### Library data of the parts
C2#1 = C01758: CAP CER 10UF 16VDC %10 X5R SMD; Manufacturer: Samsung; Manufacturer Part Number: CL21A106KOQNNNE
C3#1 C?#1-C?#8 = C01763: CAP CER 100nF 50VDC %10 X7R SMD; Manufacturer: Samsung; Manufacturer Part Number: CL10B104KB8NNNL
LED?#1-LED?#125 = YLED0402R: LED RED WATER CLEAR 0402 SMD; Manufacturer: Kingbright; Value: 0402; Manufacturer Part Number: YLED0402R
R4#1-R4#8 = 0603SAF3301T5E: RES.(1608) 0603 3.6K Ohms 1% 1/10W 100PPM SMT; Manufacturer: YAGEO; Manufacturer Part Number: RC0603FR-133K6L
U?#1-U?#8 = CAT4016HV6-GT2: Integrated Circuit; Manufacturer_Name: onsemi; Datasheet Link: https://www.onsemi.com/download/data-sheet/pdf/cat4016-d.pdf; Height: 0.8mm; Manufacturer_Part_Number: CAT4016HV6-GT2; Mouser Part Number: 698-CAT4016HV6-GT2; Mouser Price/Stock: https://www.mouser.co.uk/ProductDetail/onsemi/CAT4016HV6-GT2?qs=rZgeL6XvLwaPp0eUTTX%2FiA%3D%3D; Arrow Part Number: CAT4016HV6-GT2; Arrow Price/Stock: https://www.arrow.com/en/products/cat4016hv6-gt2/on-semiconductor

## Sheet 09_Display_Leds-2.SchDoc
size 558 x 431 mm
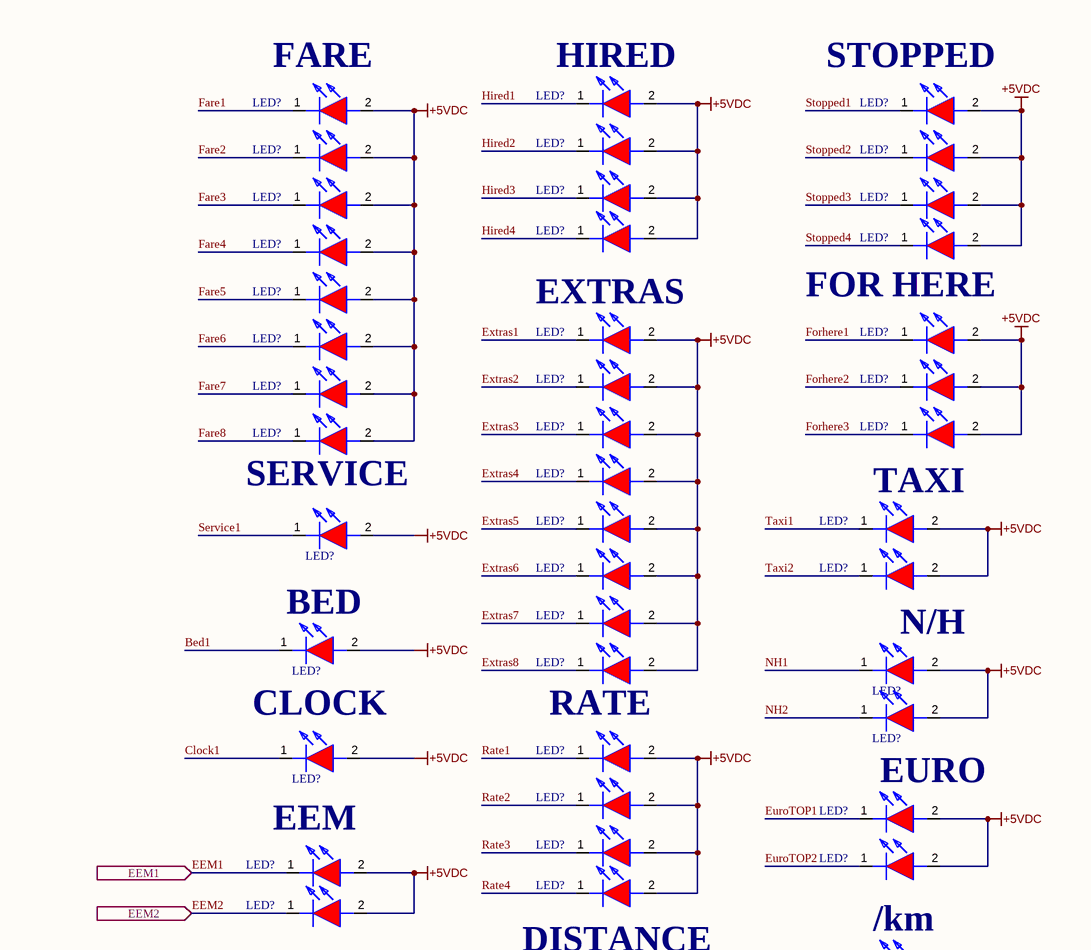
[diagram p5: 09_Display_Leds-2.SchDoc, top right]
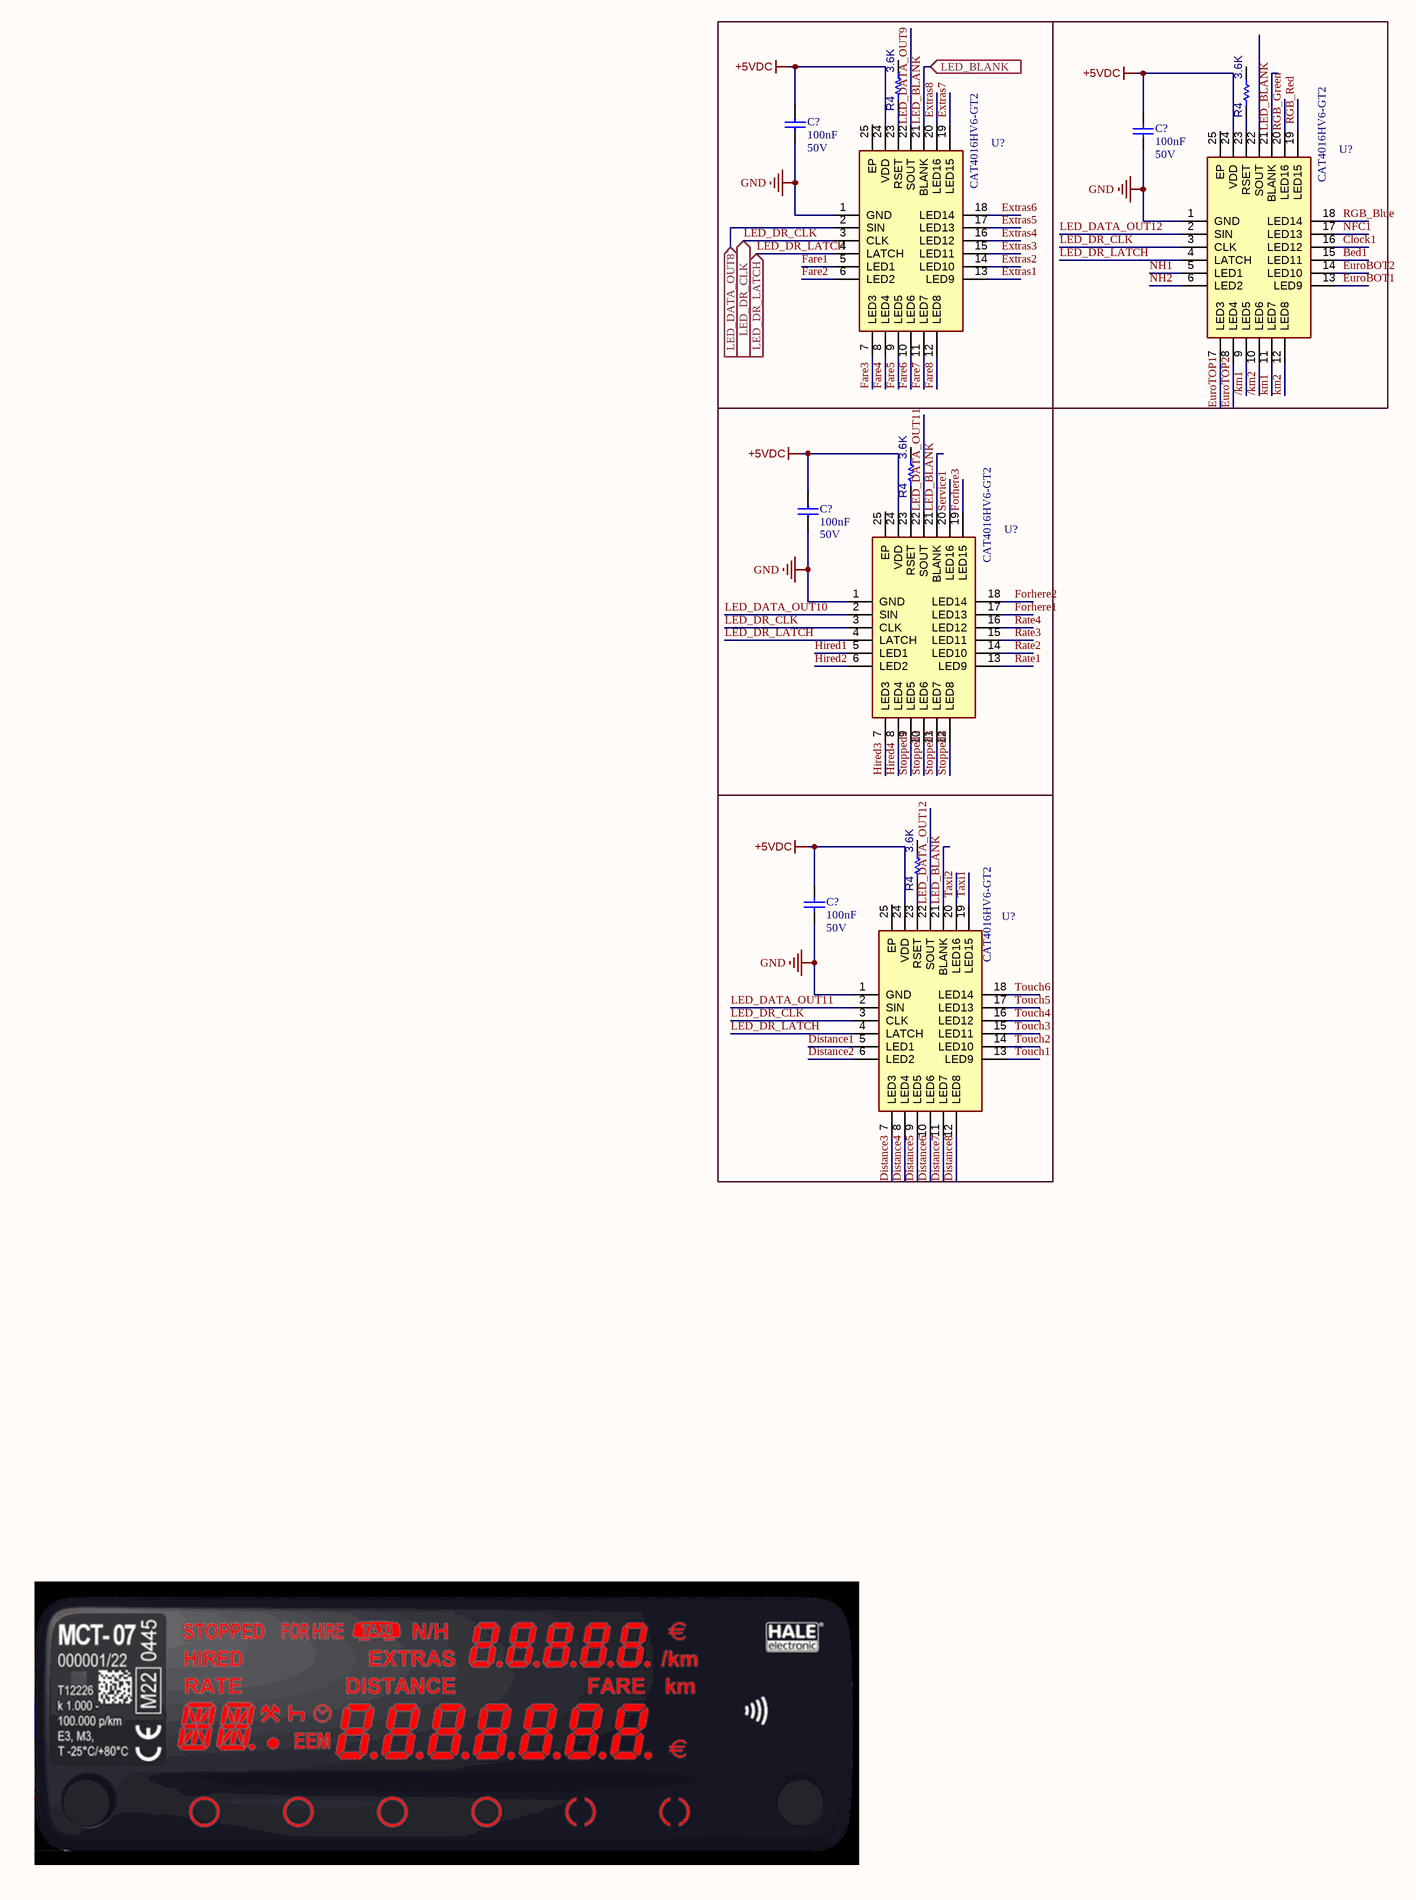
[diagram p6: 09_Display_Leds-2.SchDoc, bottom left]
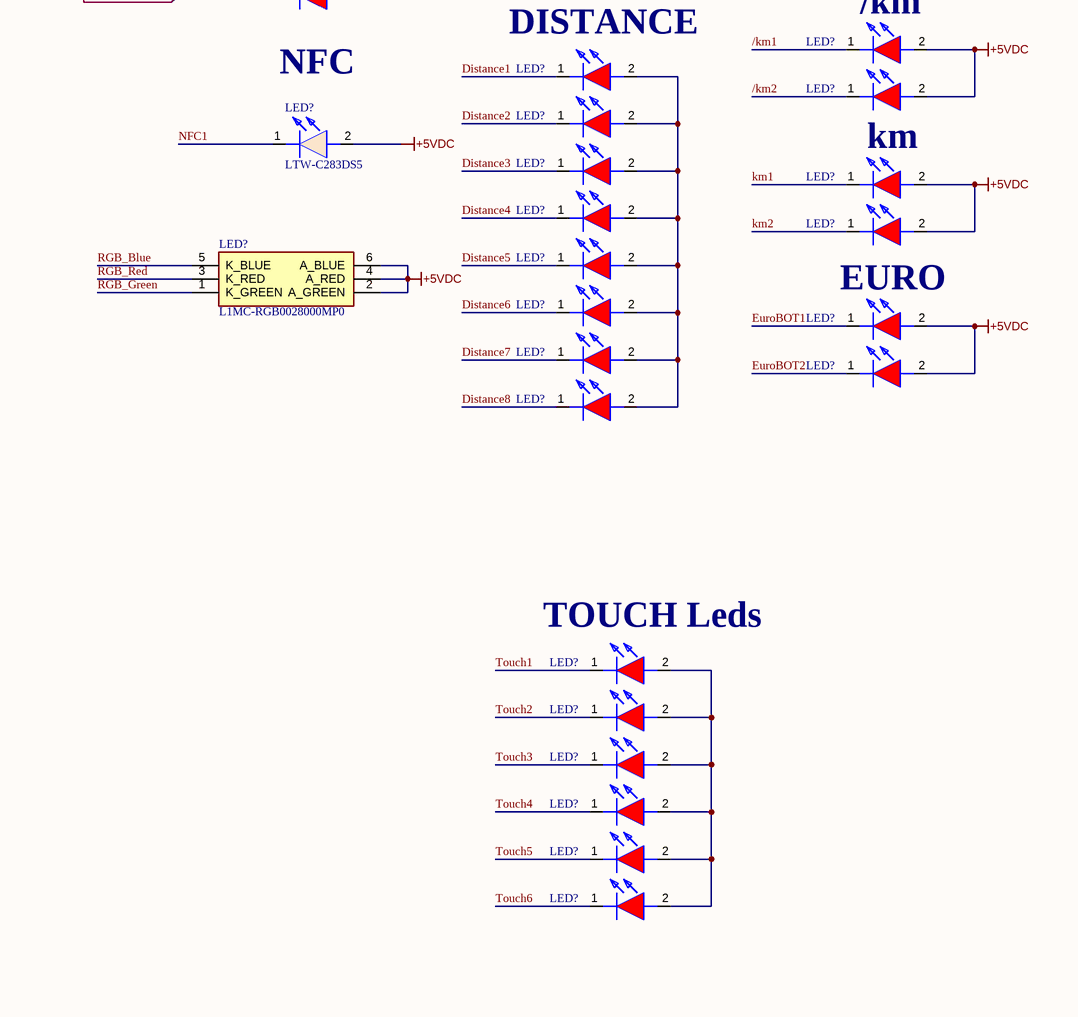
[diagram p7: 09_Display_Leds-2.SchDoc, bottom right]

### Parts
(Parts that share a designator on the sheet are numbered #1, #2 ... from top to bottom, then left to right.)
C?#9  value 100nF  Voltage: 50V  [CAP_0603]  (hidden comment: CAP)
C?#10  value 100nF  Voltage: 50V  [CAP_0603]  (hidden comment: CAP)
C?#11  value 100nF  Voltage: 50V  [CAP_0603]  (hidden comment: CAP)
C?#12  value 100nF  Voltage: 50V  [CAP_0603]  (hidden comment: CAP)
LED?#126  YLED0402R  [APHHS1005LSECKJ3PF]  (value not drawn)
LED?#127  YLED0402R  [APHHS1005LSECKJ3PF]  (value not drawn)
LED?#128  YLED0402R  [APHHS1005LSECKJ3PF]  (value not drawn)
LED?#129  YLED0402R  [APHHS1005LSECKJ3PF]  (value not drawn)
LED?#130  YLED0402R  [APHHS1005LSECKJ3PF]  (value not drawn)
LED?#131  YLED0402R  [APHHS1005LSECKJ3PF]  (value not drawn)
LED?#132  YLED0402R  [APHHS1005LSECKJ3PF]  (value not drawn)
LED?#133  YLED0402R  [APHHS1005LSECKJ3PF]  (value not drawn)
LED?#134  YLED0402R  [APHHS1005LSECKJ3PF]  (value not drawn)
LED?#135  YLED0402R  [APHHS1005LSECKJ3PF]  (value not drawn)
LED?#136  YLED0402R  [APHHS1005LSECKJ3PF]  (value not drawn)
LED?#137  YLED0402R  [APHHS1005LSECKJ3PF]  (value not drawn)
LED?#138  YLED0402R  [APHHS1005LSECKJ3PF]  (value not drawn)
LED?#139  YLED0402R  [APHHS1005LSECKJ3PF]  (value not drawn)
LED?#140  YLED0402R  [APHHS1005LSECKJ3PF]  (value not drawn)
LED?#141  YLED0402R  [APHHS1005LSECKJ3PF]  (value not drawn)
LED?#142  YLED0402R  [APHHS1005LSECKJ3PF]  (value not drawn)
LED?#143  YLED0402R  [APHHS1005LSECKJ3PF]  (value not drawn)
LED?#144  YLED0402R  [APHHS1005LSECKJ3PF]  (value not drawn)
LED?#145  YLED0402R  [APHHS1005LSECKJ3PF]  (value not drawn)
LED?#146  YLED0402R  [APHHS1005LSECKJ3PF]  (value not drawn)
LED?#147  YLED0402R  [APHHS1005LSECKJ3PF]  (value not drawn)
LED?#148  YLED0402R  [APHHS1005LSECKJ3PF]  (value not drawn)
LED?#149  YLED0402R  [APHHS1005LSECKJ3PF]  (value not drawn)
LED?#150  YLED0402R  [APHHS1005LSECKJ3PF]  (value not drawn)
LED?#151  YLED0402R  [APHHS1005LSECKJ3PF]  (value not drawn)
LED?#152  YLED0402R  [APHHS1005LSECKJ3PF]  (value not drawn)
LED?#153  YLED0402R  [APHHS1005LSECKJ3PF]  (value not drawn)
LED?#154  YLED0402R  [APHHS1005LSECKJ3PF]  (value not drawn)
LED?#155  YLED0402R  [APHHS1005LSECKJ3PF]  (value not drawn)
LED?#156  YLED0402R  [APHHS1005LSECKJ3PF]  (value not drawn)
LED?#157  YLED0402R  [APHHS1005LSECKJ3PF]  (value not drawn)
LED?#158  YLED0402R  [APHHS1005LSECKJ3PF]  (value not drawn)
LED?#159  YLED0402R  [APHHS1005LSECKJ3PF]  (value not drawn)
LED?#160  YLED0402R  [APHHS1005LSECKJ3PF]  (value not drawn)
LED?#161  YLED0402R  [APHHS1005LSECKJ3PF]  (value not drawn)
LED?#162  YLED0402R  [APHHS1005LSECKJ3PF]  (value not drawn)
LED?#163  YLED0402R  [APHHS1005LSECKJ3PF]  (value not drawn)
LED?#164  YLED0402R  [APHHS1005LSECKJ3PF]  (value not drawn)
LED?#165  YLED0402R  [APHHS1005LSECKJ3PF]  (value not drawn)
LED?#166  YLED0402R  [APHHS1005LSECKJ3PF]  (value not drawn)
LED?#167  YLED0402R  [APHHS1005LSECKJ3PF]  (value not drawn)
LED?#168  YLED0402R  [APHHS1005LSECKJ3PF]  (value not drawn)
LED?#169  YLED0402R  [APHHS1005LSECKJ3PF]  (value not drawn)
LED?#170  YLED0402R  [APHHS1005LSECKJ3PF]  (value not drawn)
LED?#171  YLED0402R  [APHHS1005LSECKJ3PF]  (value not drawn)
LED?#172  LTW-C283DS5  [APHHS1005LSECKJ3PF]
LED?#173  YLED0402R  [APHHS1005LSECKJ3PF]  (value not drawn)
LED?#174  YLED0402R  [APHHS1005LSECKJ3PF]  (value not drawn)
LED?#175  YLED0402R  [APHHS1005LSECKJ3PF]  (value not drawn)
LED?#176  YLED0402R  [APHHS1005LSECKJ3PF]  (value not drawn)
LED?#177  L1MC-RGB0028000MP0  [L1MCRGB0028000MP0]
LED?#178  YLED0402R  [APHHS1005LSECKJ3PF]  (value not drawn)
LED?#179  YLED0402R  [APHHS1005LSECKJ3PF]  (value not drawn)
LED?#180  YLED0402R  [APHHS1005LSECKJ3PF]  (value not drawn)
LED?#181  YLED0402R  [APHHS1005LSECKJ3PF]  (value not drawn)
LED?#182  YLED0402R  [APHHS1005LSECKJ3PF]  (value not drawn)
LED?#183  YLED0402R  [APHHS1005LSECKJ3PF]  (value not drawn)
LED?#184  YLED0402R  [APHHS1005LSECKJ3PF]  (value not drawn)
LED?#185  YLED0402R  [APHHS1005LSECKJ3PF]  (value not drawn)
LED?#186  YLED0402R  [APHHS1005LSECKJ3PF]  (value not drawn)
LED?#187  YLED0402R  [APHHS1005LSECKJ3PF]  (value not drawn)
LED?#188  YLED0402R  [APHHS1005LSECKJ3PF]  (value not drawn)
LED?#189  YLED0402R  [APHHS1005LSECKJ3PF]  (value not drawn)
R4#9  value 3.6K  [RES_0603]  (hidden comment: RC0603FR-133K6L)
R4#10  value 3.6K  [RES_0603]  (hidden comment: RC0603FR-133K6L)
R4#11  value 3.6K  [RES_0603]  (hidden comment: RC0603FR-133K6L)
R4#12  value 3.6K  [RES_0603]  (hidden comment: RC0603FR-133K6L)
U?#9  CAT4016HV6-GT2  [QFN50P400X400X80-25N-D]
U?#10  CAT4016HV6-GT2  [QFN50P400X400X80-25N-D]
U?#11  CAT4016HV6-GT2  [QFN50P400X400X80-25N-D]
U?#12  CAT4016HV6-GT2  [QFN50P400X400X80-25N-D]

### Ports
EEM1 (in), EEM2 (in), LED_BLANK (in), LED_DATA_OUT8 (in), LED_DR_CLK (in), LED_DR_LATCH (in)

### Nets
+5VDC: C?#9.1 C?#10.1 C?#11.1 C?#12.1 LED?#126.2(A) LED?#127.2(A) LED?#128.2(A) LED?#129.2(A) LED?#130.2(A) LED?#131.2(A) LED?#132.2(A) LED?#133.2(A) LED?#134.2(A) LED?#135.2(A) LED?#136.2(A) LED?#137.2(A) LED?#138.2(A) LED?#139.2(A) LED?#140.2(A) LED?#141.2(A) LED?#142.2(A) LED?#143.2(A) LED?#144.2(A) LED?#145.2(A) LED?#146.2(A) LED?#147.2(A) LED?#148.2(A) LED?#149.2(A) LED?#150.2(A) LED?#151.2(A) LED?#152.2(A) LED?#153.2(A) LED?#154.2(A) LED?#155.2(A) LED?#156.2(A) LED?#157.2(A) LED?#158.2(A) LED?#159.2(A) LED?#160.2(A) LED?#161.2(A) LED?#162.2(A) LED?#163.2(A) LED?#164.2(A) LED?#165.2(A) LED?#166.2(A) LED?#167.2(A) LED?#168.2(A) LED?#170.2(A) LED?#172.2(A) LED?#174.2(A) LED?#176.2(A) LED?#177.2(A_GREEN) LED?#177.4(A_RED) LED?#177.6(A_BLUE) LED?#180.2(A) LED?#182.2(A) U?#9.24(VDD) U?#10.24(VDD) U?#11.24(VDD) U?#12.24(VDD)
GND: C?#9.2 C?#10.2 C?#11.2 C?#12.2 U?#9.1(GND) U?#10.1(GND) U?#11.1(GND) U?#12.1(GND)  [project net TVSS]
/km1: LED?#168.1(K) U?#10.9(LED5)
/km2: LED?#170.1(K) U?#10.10(LED6)
Bed1: LED?#155.1(K) U?#10.15(LED11)
Clock1: LED?#159.1(K) U?#10.16(LED12)
Distance1: LED?#169.1(K) U?#12.5(LED1)
Distance2: LED?#171.1(K) U?#12.6(LED2)
Distance3: LED?#173.1(K) U?#12.7(LED3)
Distance4: LED?#175.1(K) U?#12.8(LED4)
Distance5: LED?#178.1(K) U?#12.9(LED5)
Distance6: LED?#179.1(K) U?#12.10(LED6)
Distance7: LED?#181.1(K) U?#12.11(LED7)
Distance8: LED?#183.1(K) U?#12.12(LED8)
EEM1: LED?#165.1(K) ; port EEM1
EEM2: LED?#167.1(K) ; port EEM2
EuroBOT1: LED?#180.1(K) U?#10.13(LED9)
EuroBOT2: LED?#182.1(K) U?#10.14(LED10)
EuroTOP1: LED?#162.1(K) U?#10.7(LED3)
EuroTOP2: LED?#164.1(K) U?#10.8(LED4)
Extras1: LED?#139.1(K) U?#9.13(LED9)
Extras2: LED?#142.1(K) U?#9.14(LED10)
Extras3: LED?#145.1(K) U?#9.15(LED11)
Extras4: LED?#148.1(K) U?#9.16(LED12)
Extras5: LED?#149.1(K) U?#9.17(LED13)
Extras6: LED?#152.1(K) U?#9.18(LED14)
Extras7: LED?#154.1(K) U?#9.19(LED15)
Extras8: LED?#156.1(K) U?#9.20(LED16)
Fare1: LED?#127.1(K) U?#9.5(LED1)
Fare2: LED?#130.1(K) U?#9.6(LED2)
Fare3: LED?#133.1(K) U?#9.7(LED3)
Fare4: LED?#137.1(K) U?#9.8(LED4)
Fare5: LED?#138.1(K) U?#9.9(LED5)
Fare6: LED?#141.1(K) U?#9.10(LED6)
Fare7: LED?#144.1(K) U?#9.11(LED7)
Fare8: LED?#147.1(K) U?#9.12(LED8)
Forhere1: LED?#140.1(K) U?#11.17(LED13)
Forhere2: LED?#143.1(K) U?#11.18(LED14)
Forhere3: LED?#146.1(K) U?#11.19(LED15)
Hired1: LED?#126.1(K) U?#11.5(LED1)
Hired2: LED?#129.1(K) U?#11.6(LED2)
Hired3: LED?#132.1(K) U?#11.7(LED3)
Hired4: LED?#135.1(K) U?#11.8(LED4)
km1: LED?#174.1(K) U?#10.11(LED7)
km2: LED?#176.1(K) U?#10.12(LED8)
LED_BLANK: U?#9.21(BLANK) U?#10.21(BLANK) U?#11.21(BLANK) U?#12.21(BLANK) ; port LED_BLANK
LED_DATA_OUT9: U?#9.22(SOUT)
LED_DATA_OUT10: U?#11.2(SIN)
LED_DATA_OUT11: U?#11.22(SOUT) U?#12.2(SIN)
LED_DATA_OUT12: U?#10.2(SIN) U?#12.22(SOUT)
LED_DR_CLK: U?#9.3(CLK) U?#10.3(CLK) U?#11.3(CLK) U?#12.3(CLK) ; port LED_DR_CLK
LED_DR_LATCH: U?#9.4(LATCH) U?#10.4(LATCH) U?#11.4(LATCH) U?#12.4(LATCH) ; port LED_DR_LATCH
NFC1: LED?#172.1(K) U?#10.17(LED13)
NH1: LED?#157.1(K) U?#10.5(LED1)
NH2: LED?#158.1(K) U?#10.6(LED2)
Rate1: LED?#160.1(K) U?#11.13(LED9)
Rate2: LED?#161.1(K) U?#11.14(LED10)
Rate3: LED?#163.1(K) U?#11.15(LED11)
Rate4: LED?#166.1(K) U?#11.16(LED12)
RGB_Blue: LED?#177.5(K_BLUE) U?#10.18(LED14)
RGB_Green: LED?#177.1(K_GREEN) U?#10.20(LED16)
RGB_Red: LED?#177.3(K_RED) U?#10.19(LED15)
Service1: LED?#151.1(K) U?#11.20(LED16)
Stopped1: LED?#128.1(K) U?#11.9(LED5)
Stopped2: LED?#131.1(K) U?#11.10(LED6)
Stopped3: LED?#134.1(K) U?#11.11(LED7)
Stopped4: LED?#136.1(K) U?#11.12(LED8)
Taxi1: LED?#150.1(K) U?#12.19(LED15)
Taxi2: LED?#153.1(K) U?#12.20(LED16)
Touch1: LED?#184.1(K) U?#12.13(LED9)
Touch2: LED?#185.1(K) U?#12.14(LED10)
Touch3: LED?#186.1(K) U?#12.15(LED11)
Touch4: LED?#187.1(K) U?#12.16(LED12)
Touch5: LED?#188.1(K) U?#12.17(LED13)
Touch6: LED?#189.1(K) U?#12.18(LED14)
NetLED?#169_2: LED?#169.2(A) LED?#171.2(A) LED?#173.2(A) LED?#175.2(A) LED?#178.2(A) LED?#179.2(A) LED?#181.2(A) LED?#183.2(A)
NetLED?#184_2: LED?#184.2(A) LED?#185.2(A) LED?#186.2(A) LED?#187.2(A) LED?#188.2(A) LED?#189.2(A)
NetR4#9_1: R4#9.1 U?#9.23(RSET)
NetR4#10_1: R4#10.1 U?#10.23(RSET)
NetR4#11_1: R4#11.1 U?#11.23(RSET)
NetR4#12_1: R4#12.1 U?#12.23(RSET)
NetU?#9_2: U?#9.2(SIN) ; port LED_DATA_OUT8

Not connected (* = marked no-connect by the designer): R4#9 2; R4#10 2; R4#11 2; R4#12 2; U?#9 25(EP); U?#10 22(SOUT) 25(EP); U?#11 25(EP); U?#12 25(EP)

### Notes on the sheet
- (near LED?#127) FARE
- (near LED?#126) HIRED
- (near LED?#128) STOPPED
- (near LED?#139) EXTRAS
- (near LED?#136) FOR HERE
- (near LED?#147) SERVICE
- (near LED?#146) TAXI
- (near LED?#155) BED
- (near LED?#153) N/H
- (near LED?#155) CLOCK
- (near LED?#156) RATE
- (near LED?#162) EURO
- (near LED?#165) EEM
- (near LED?#167) NFC
- (near LED?#166) DISTANCE
- (near LED?#168) /km
- (near LED?#170) km
- (near LED?#176) EURO
- (near LED?#184) TOUCH Leds
- DWG. NO.
- REV.
- SHT.
- REVISION
- DESCRIPTION
- DATE
- APPROVED
- THIS DOCUMENT AND THE DATA DISCLOSED HEREIN OR HEREWITH IS THE PROPERTY OF ALTIUM LIMITED AND MAY BE FREELY DISTRIBUTED IN WHOLE. NO RIGHTS ARE RESERVED OR EXPRESS OR IMPLIED WARANTEE GIVEN.
- ENG:
- DSN:
- APPROVALS
- PROJECT
- DOCUMENT REVISION:
- DESIGN ITEM:
- CHK:
- BOM:
- REFERENCE DOCUMENTS
- PROJECT REVISION:
- TITLE
- FAB DWG:
- PCB DWG:
- ASSY DWG:
- SCALE:
- SIZE
- C
- CAGE CODE
- FILE NAME
- DWG NO.
- SHEET
- OF
- REV

### Library data of the parts
C?#9-C?#12 = C01763: as C3#1 on sheet 08_Display_Leds
LED?#126-LED?#171 LED?#173-LED?#176 LED?#178-LED?#189 = YLED0402R: as LED?#1 on sheet 08_Display_Leds; Manufacturer Part Number: YLED0402R
LED?#172 = LTW-C283DS5: LED WHITE YELLOW LENS 0402 SMD; Manufacturer: LITEON; Value: 0402; Manufacturer Part Number: LTW-C283DS5
LED?#177 = L1MC-RGB0028000MP0: LED; Manufacturer_Name: Lumileds; Datasheet Link: https://lumileds.com/wp-content/uploads/2022/03/DS388-luxeon-3528-rgb-datasheet.pdf; Height: 1.85mm; Manufacturer_Part_Number: L1MC-RGB0028000MP0; Mouser Part Number: 997-L1MCRGB00280MP; Mouser Price/Stock: https://www.mouser.co.uk/ProductDetail/Lumileds/L1MC-RGB0028000MP0?qs=Znm5pLBrcAJSGF05jr80lQ%3D%3D; Arrow Part Number: L1MC-RGB0028000MP0; Arrow Price/Stock: https://www.arrow.com/en/products/l1mc-rgb0028000mp0/lumileds.html?utm_currency=USD&region=nac
R4#9-R4#12 = 0603SAF3301T5E: as R4#1 on sheet 08_Display_Leds; Manufacturer Part Number: RC0603FR-133K6L
U?#9-U?#12 = CAT4016HV6-GT2: as U?#1 on sheet 08_Display_Leds; Datasheet Link: https://www.onsemi.com/download/data-sheet/pdf/cat4016-d.pdf; Height: 0.8mm; Manufacturer_Part_Number: CAT4016HV6-GT2; Mouser Part Number: 698-CAT4016HV6-GT2; Mouser Price/Stock: https://www.mouser.co.uk/ProductDetail/onsemi/CAT4016HV6-GT2?qs=rZgeL6XvLwaPp0eUTTX%2FiA%3D%3D; Arrow Part Number: CAT4016HV6-GT2; Arrow Price/Stock: https://www.arrow.com/en/products/cat4016hv6-gt2/on-semiconductor

## Sheet 07_LTE_GNSS.SchDoc: LTE_GNSS
size 420 x 297 mm; DrawnBy: YILDIRIM_DOGRU
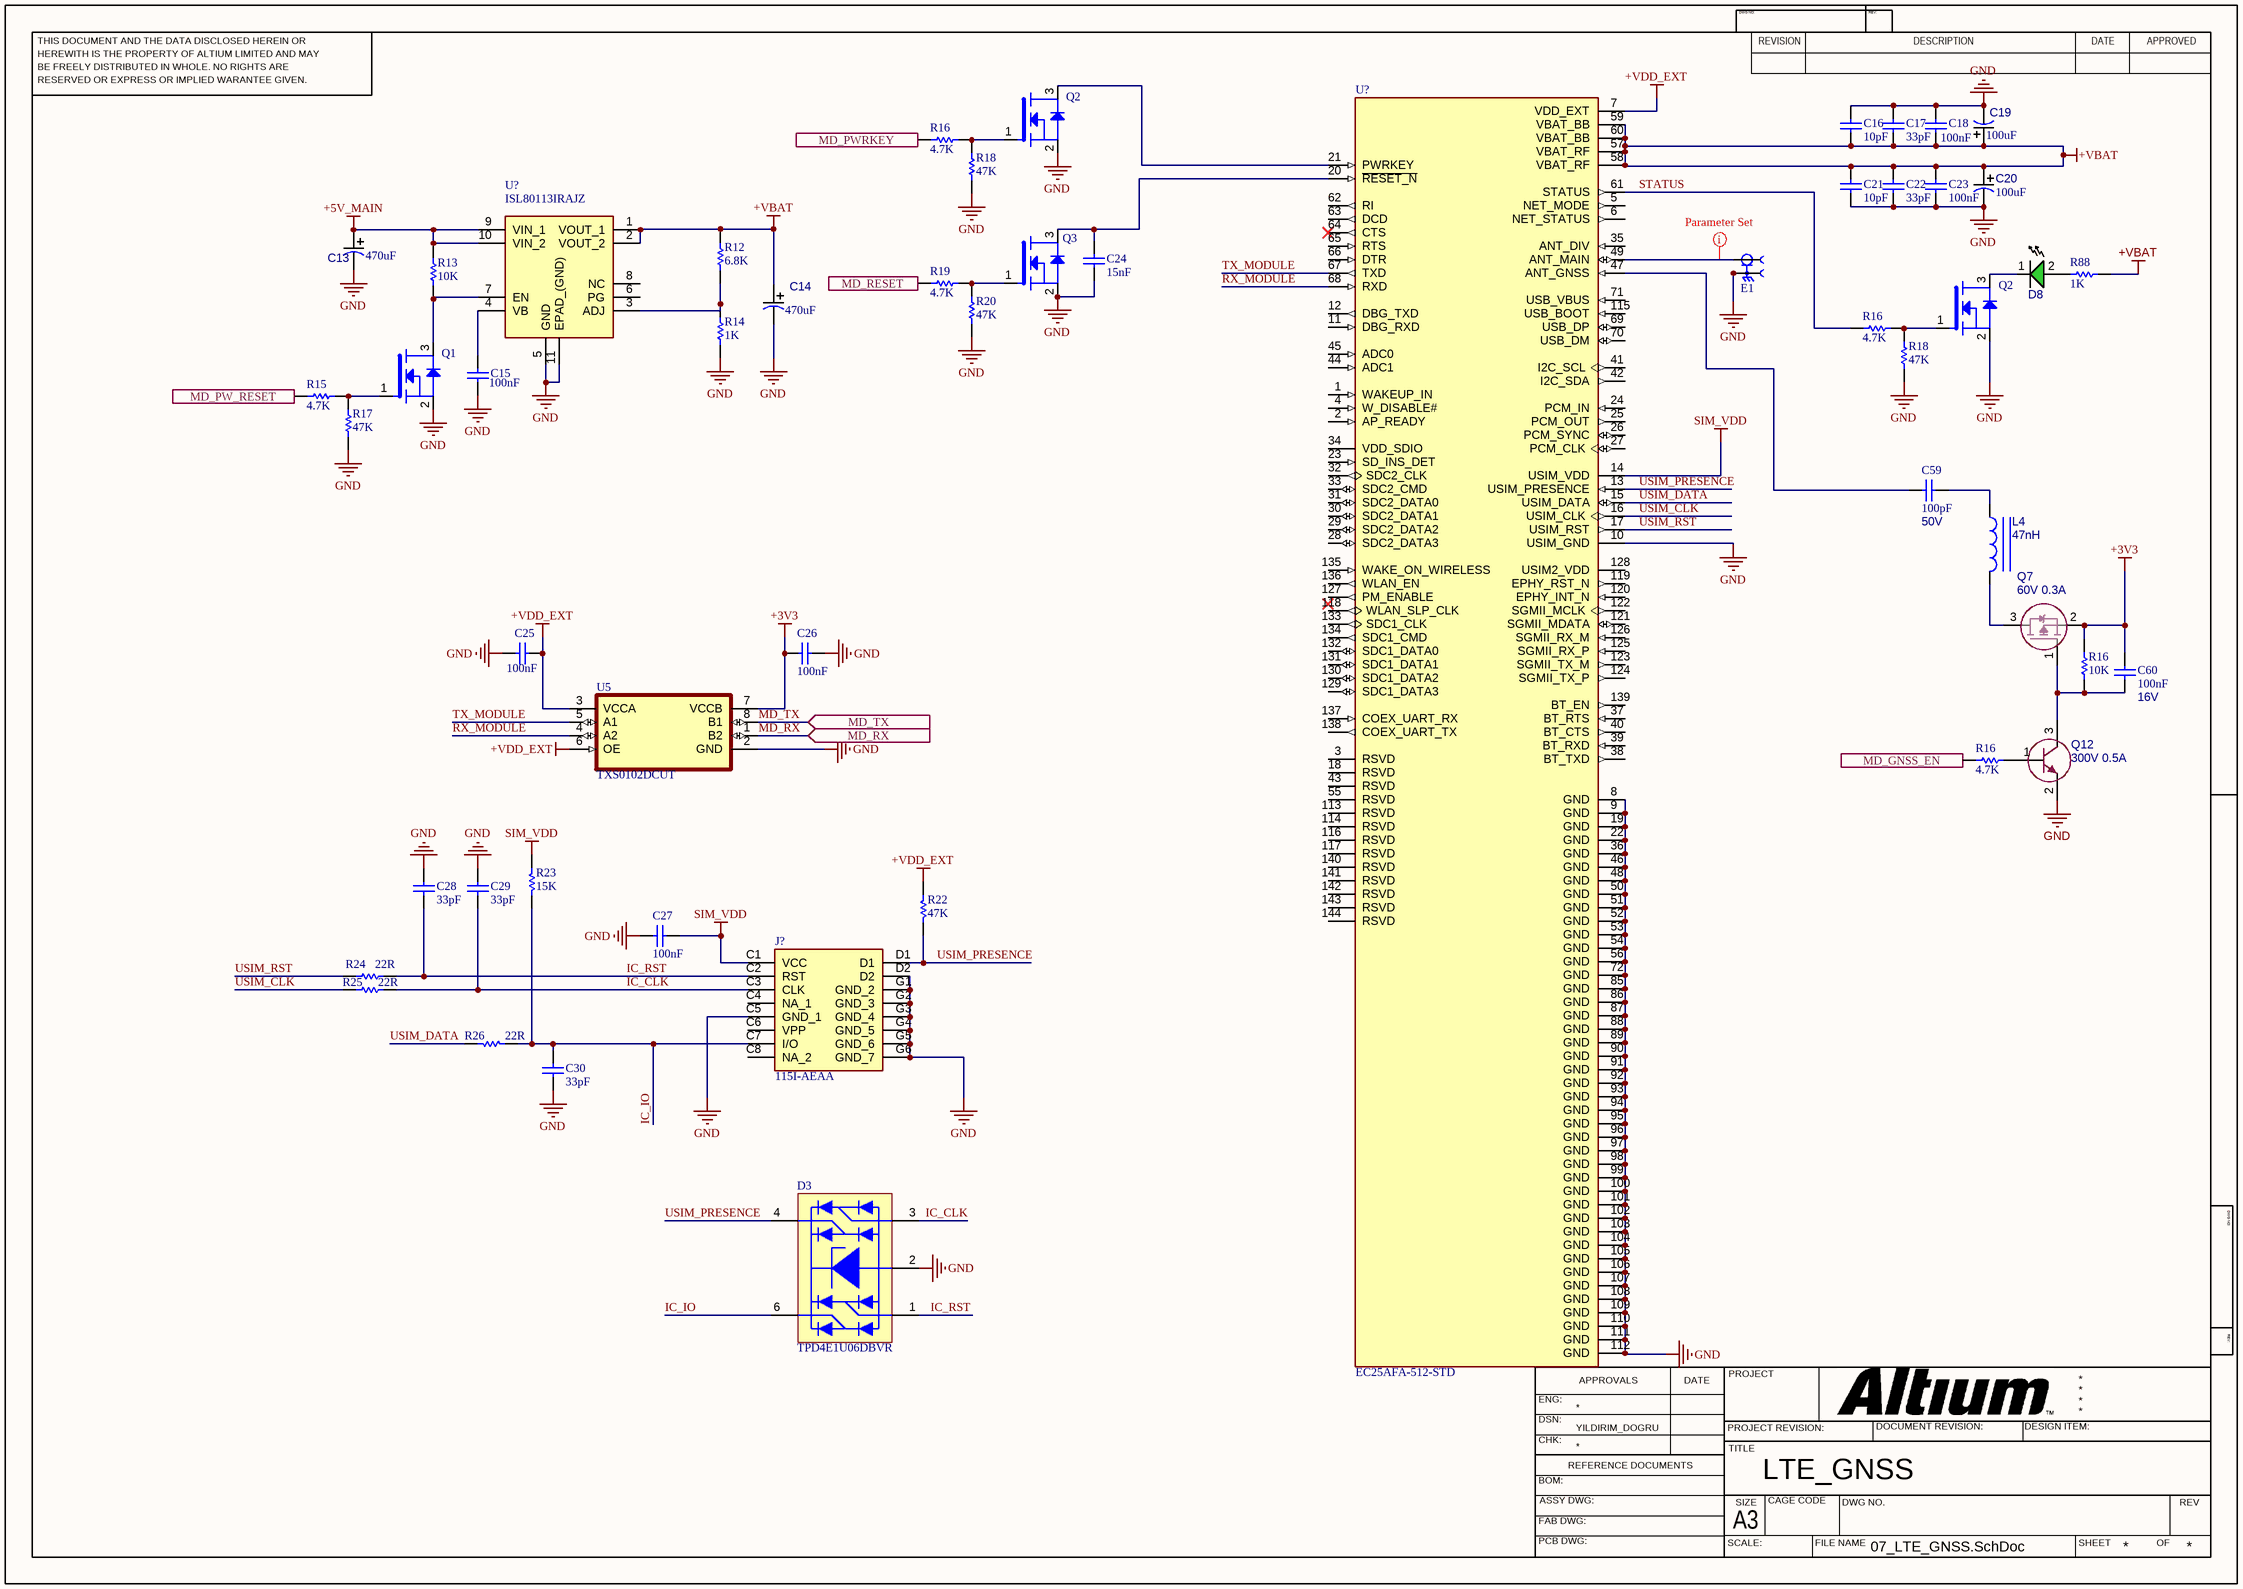
[diagram p8: 07_LTE_GNSS.SchDoc]

### Parts
(Parts that share a designator on the sheet are numbered #1, #2 ... from top to bottom, then left to right.)
C13  value 470uF  [CAP_ELEC_8X10.5 mm]  (hidden comment: MRW-016V471MF105-T/R)
C14  value 470uF  [CAP_ELEC_8X10.5 mm]  (hidden comment: MRW-016V471MF105-T/R)
C15#1  value 100nF  [CAP_0603]  (hidden comment: CL10B104KB8NNNL)
C16  value 10pF  [CAP_0603]  (hidden comment: CL10C100CB8NNNC)
C17  value 33pF  [CAP_0603]  (hidden comment: CL10C330JB8NNNC)
C18  value 100nF  [CAP_0603]  (hidden comment: CL10B104KB8NNNL)
C19  value 100uF  [TANTALIUM_BCASE]  (hidden comment: T491B107K006AT)
C20  value 100uF  [TANTALIUM_BCASE]  (hidden comment: T491B107K006AT)
C21  value 10pF  [CAP_0603]  (hidden comment: CL10C100CB8NNNC)
C22  value 33pF  [CAP_0603]  (hidden comment: CL10C330JB8NNNC)
C23  value 100nF  [CAP_0603]  (hidden comment: CL10B104KB8NNNL)
C24  value 15nF  [CAP_0603]  (hidden comment: CL10B153KB85PNC)
C25  value 100nF  [CAP_0603]  (hidden comment: CL10B104KB8NNNL)
C26  value 100nF  [CAP_0603]  (hidden comment: CL10B104KB8NNNL)
C27  value 100nF  [CAP_0603]  (hidden comment: CL10B104KB8NNNL)
C28#1  value 33pF  [CAP_0603]  (hidden comment: CL10C330JB8NNNC)
C29#1  value 33pF  [CAP_0603]  (hidden comment: CL10C330JB8NNNC)
C30  value 33pF  [CAP_0603]  (hidden comment: CL10C330JB8NNNC)
C59  value 100pF  Voltage: 50V  [CAP_0402]  (hidden comment: CC0402JRNPO9BN101)
C60  value 100nF  Voltage: 16V  [CAP_0402]  (hidden comment: CL05B104KO5NNNC)
D3#1  TPD4E1U06DBVR  [SOT23_6]
D8#1  LTST-C190TGKT  [LED_0603_GREEN]  (value not drawn)
E1  L-KLS1-SMA002-B  [SMA_JACK_90]  (value not drawn)
J?#1  115I-AEAA  [115IAEAA]
L4  value 47nH  [RES_0402]  (hidden comment: LQG15HS47NJ02D)
Q1  BSS138W-7-F  [SOT323]  (value not drawn)
Q2#1  BSS138W-7-F  [SOT323]  (value not drawn)
Q2#2  BSS138W-7-F  [SOT323]  (value not drawn)
Q3  BSS138W-7-F  [SOT323]  (value not drawn)
Q7  value 60V 0.3A  [SOT23]  (hidden comment: PJA3439_R1_00001)
Q12#1  value 300V 0.5A  [SOT-23-3]  (hidden comment: MMBTA42_R1_00001)
R12  value 6.8K  [RES_0603]  (hidden comment: 0603SAF6801T5E)
R13  value 10K  [RES_0603]  (hidden comment: 0603SAF1002T5E)
R14#1  value 1K  [RES_0603]  (hidden comment: 0603SAF1001T5E)
R15#1  value 4.7K  [RES_0603]  (hidden comment: 0603SAF4701T5E)
R16#1  value 4.7K  [RES_0603]  (hidden comment: 0603SAF4701T5E)
R16#2  value 4.7K  [RES_0603]  (hidden comment: 0603SAF4701T5E)
R16#3  value 10K  [RES_0402]  (hidden comment: RC0402JR-0710KL)
R16#4  value 4.7K  [RES_0603]  (hidden comment: 0603SAF4701T5E)
R17  value 47K  [RES_0603]  (hidden comment: 0603SAF4702T5E)
R18#1  value 47K  [RES_0603]  (hidden comment: 0603SAF4702T5E)
R18#2  value 47K  [RES_0603]  (hidden comment: 0603SAF4702T5E)
R19  value 4.7K  [RES_0603]  (hidden comment: 0603SAF4701T5E)
R20#1  value 47K  [RES_0603]  (hidden comment: 0603SAF4702T5E)
R22  value 47K  [RES_0603]  (hidden comment: 0603SAF4702T5E)
R23  value 15K  [RES_0603]  (hidden comment: 0603SAJ0153T5E)
R24  value 22R  [RES_0603]  (hidden comment: 0603SAJ0220T5E)
R25  value 22R  [RES_0603]  (hidden comment: 0603SAJ0220T5E)
R26  value 22R  [RES_0603]  (hidden comment: 0603SAJ0220T5E)
R88  value 1K  [RES_0603]  (hidden comment: RES)
U5  TXS0102DCUT  [8_VSSOP]
U?#13  EC25AFA-512-STD  [XCVR_EC25AFA-512-STD]
U?#14  ISL80113IRAJZ  [ISL80101IRAJZ]

### Ports
MD_GNSS_EN (in), MD_PW_RESET (in), MD_PWRKEY (in), MD_RESET (in), MD_RX (in), MD_TX (in)

### Nets
+3V3: C26.1 C60.1 Q7.2(S) R16#3.1 U5.7(VCCB)
+5V_MAIN: C13.1 R13.2 U?#14.9(VIN_1) U?#14.10(VIN_2)
+VBAT: C14.1 C16.1 C17.1 C18.1 C19.1 C20.1 C21.2 C22.2 C23.2 R12.2 R88.2 U?#13.57(VBAT_RF) U?#13.58(VBAT_RF) U?#13.59(VBAT_BB) U?#13.60(VBAT_BB) U?#14.1(VOUT_1) U?#14.2(VOUT_2)
+VDD_EXT: C25.1 R22.2 U5.3(VCCA) U5.6(OE) U?#13.7(VDD_EXT)
GND: C13.2 C14.2 C15#1.1 C16.2 C17.2 C18.2 C19.2 C20.2 C21.1 C22.1 C23.1 C24.1 C25.2 C26.2 C27.2 C28#1.1 C29#1.1 C30.1 D3#1.2 E1.S1 E1.S2 E1.S3 E1.S4 J?#1.C5(GND_1) J?#1.D2 J?#1.G1(GND_2) J?#1.G2(GND_3) J?#1.G3(GND_4) J?#1.G4(GND_5) J?#1.G5(GND_6) J?#1.G6(GND_7) Q1.2(S) Q2#1.2(S) Q2#2.2(S) Q3.2(S) Q12#1.2(E) R14#1.1 R17.1 R18#1.1 R18#2.1 R20#1.1 U5.2(GND) U?#13.8(GND) U?#13.9(GND) U?#13.10(USIM_GND) U?#13.19(GND) U?#13.22(GND) U?#13.36(GND) U?#13.46(GND) U?#13.48(GND) U?#13.50(GND) U?#13.51(GND) U?#13.52(GND) U?#13.53(GND) U?#13.54(GND) U?#13.56(GND) U?#13.72(GND) U?#13.85(GND) U?#13.86(GND) U?#13.87(GND) U?#13.88(GND) U?#13.89(GND) U?#13.90(GND) U?#13.91(GND) U?#13.92(GND) U?#13.93(GND) U?#13.94(GND) U?#13.95(GND) U?#13.96(GND) U?#13.97(GND) U?#13.98(GND) U?#13.99(GND) U?#13.100(GND) U?#13.101(GND) U?#13.102(GND) U?#13.103(GND) U?#13.104(GND) U?#13.105(GND) U?#13.106(GND) U?#13.107(GND) U?#13.108(GND) U?#13.109(GND) U?#13.110(GND) U?#13.111(GND) U?#13.112(GND) U?#14.5(GND) U?#14.11(EPAD_(GND))  [project net TVSS]
SIM_VDD: C27.1 J?#1.C1(VCC) R23.2 U?#13.14(USIM_VDD)
IC_CLK: C29#1.2 D3#1.3 J?#1.C3(CLK) R25.2
IC_IO: C30.2 D3#1.6 J?#1.C7(I/O) R23.1 R26.1
IC_RST: C28#1.2 D3#1.1 J?#1.C2(RST) R24.2
MD_RX: U5.1(B2) ; port MD_RX
MD_TX: U5.8(B1) ; port MD_TX
RX_MODULE: U5.4(A2) U?#13.68(RXD)
STATUS: R16#2.1 U?#13.61(STATUS)
TX_MODULE: U5.5(A1) U?#13.67(TXD)
USIM_CLK: R25.1 U?#13.16(USIM_CLK)
USIM_DATA: R26.2 U?#13.15(USIM_DATA)
USIM_PRESENCE: D3#1.4 J?#1.D1 R22.1 U?#13.13(USIM_PRESENCE)
USIM_RST: R24.1 U?#13.17(USIM_RST)
NetC15#1_2: C15#1.2 U?#14.4(VB)
NetC24_2: C24.2 Q3.3(D) U?#13.20(~{RESET_N})
NetC59_1: C59.1 L4.1
NetC59_2: C59.2 U?#13.47(ANT_GNSS)
NetC60_2: C60.2 Q7.1(G) Q12#1.3(C) R16#3.2
NetD8#1_1: D8#1.1 Q2#2.3(D)
NetD8#1_2: D8#1.2 R88.1
NetE1_1: E1.1 U?#13.49(ANT_MAIN)
NetL4_2: L4.2 Q7.3(D)
NetQ1_1: Q1.1(G) R15#1.2 R17.2
NetQ1_3: Q1.3(D) R13.1 U?#14.7(EN)
NetQ2#1_1: Q2#1.1(G) R16#1.2 R18#1.2
NetQ2#1_3: Q2#1.3(D) U?#13.21(PWRKEY)
NetQ2#2_1: Q2#2.1(G) R16#2.2 R18#2.2
NetQ3_1: Q3.1(G) R19.2 R20#1.2
NetQ12#1_1: Q12#1.1(B) R16#4.2
NetR12_1: R12.1 R14#1.2 U?#14.3(ADJ)
NetR15#1_1: R15#1.1 ; port MD_PW_RESET
NetR16#1_1: R16#1.1 ; port MD_PWRKEY
NetR16#4_1: R16#4.1 ; port MD_GNSS_EN
NetR19_1: R19.1 ; port MD_RESET

Not connected (* = marked no-connect by the designer): J?#1 C4(NA_1) C6(VPP) C8(NA_2); U?#13 1(WAKEUP_IN) 2(AP_READY) 3(RSVD) 4(W_DISABLE#) 5(NET_MODE) 6(NET_STATUS) 11(DBG_RXD) 12(DBG_TXD) 18(RSVD) 23(SD_INS_DET) 24(PCM_IN) 25(PCM_OUT) 26(PCM_SYNC) 27(PCM_CLK) 28(SDC2_DATA3) 29(SDC2_DATA2) 30(SDC2_DATA1) 31(SDC2_DATA0) 32(SDC2_CLK) 33(SDC2_CMD) 34(VDD_SDIO) 35(ANT_DIV) 37(BT_RTS) 38(BT_TXD) 39(BT_RXD) 40(BT_CTS) 41(I2C_SCL) 42(I2C_SDA) 43(RSVD) 44(ADC1) 45(ADC0) 55(RSVD) 62(RI) 63(DCD) 64(CTS)* 65(RTS) 66(DTR) 69(USB_DP) 70(USB_DM) 71(USB_VBUS) 113(RSVD) 114(RSVD) 115(USB_BOOT) 116(RSVD) 117(RSVD) 118(WLAN_SLP_CLK) 119(EPHY_RST_N) 120(EPHY_INT_N) 121(SGMII_MDATA) 122(SGMII_MCLK) 123(SGMII_TX_M) 124(SGMII_TX_P) 125(SGMII_RX_P) 126(SGMII_RX_M) 127(PM_ENABLE) 128(USIM2_VDD) 129(SDC1_DATA3) 130(SDC1_DATA2) 131(SDC1_DATA1) 132(SDC1_DATA0) 133(SDC1_CLK) 134(SDC1_CMD) 135(WAKE_ON_WIRELESS) 136(WLAN_EN) 137(COEX_UART_RX) 138(COEX_UART_TX) 139(BT_EN) 140(RSVD) 141(RSVD) 142(RSVD) 143(RSVD) 144(RSVD); U?#14 6(PG) 8(NC)

### Layout directives
rule Width Constraint [Pref Width = 0.389mm    Min Width = 0.254mm    Max Width = 0.389mm]: NetE1_1

### Notes on the sheet
- THIS DOCUMENT AND THE DATA DISCLOSED HEREIN OR
- HEREWITH IS THE PROPERTY OF ALTIUM LIMITED AND MAY
- DWG NO:
- REVISION
- REV:
- DESCRIPTION
- DATE
- APPROVED
- BE FREELY DISTRIBUTED IN WHOLE. NO RIGHTS ARE
- RESERVED OR EXPRESS OR IMPLIED WARANTEE GIVEN.
- ENG:
- APPROVALS
- PROJECT
- DSN:
- CHK:
- REFERENCE DOCUMENTS
- PROJECT REVISION:
- TITLE
- DOCUMENT REVISION:
- DESIGN ITEM:
- BOM:
- FAB DWG:
- PCB DWG:
- ASSY DWG:
- SCALE:
- A3
- SIZE
- CAGE CODE
- FILE NAME
- DWG NO.
- SHEET
- OF
- REV

### Library data of the parts
C13 C14 = MRW-016V471MF105-T/R: CAP.EL.470uF 16V 8x10.5 105C 2000Hrs SMD; Manufacturer: KOSHIN; Manufacturer Part Number: MRW-016V471MF105-T/R; Supplier 1: Ozdisan
C15#1 C18 C23 C25-C27 = CL10B104KB8NNNL: MLCC (1608) 0603 100nF 50VDC ±10% X7R; Manufacturer: Samsung Electro-Mechanics America, Inc; Supplier 1: OZDISAN; Manufacturer Part Number: CL10B104KB8NNNL
C16 C21 = CL10C100CB8NNNC: MLCC (1608) 0603 10pF 50VDC ±0.25pF C0G (NP0); Manufacturer: SAMSUNG; Supplier 1: Ozdisan; Manufacturer Part Number: CL10C100CB8NNNC
C17 C22 C28#1 C29#1 C30 = CL10C330JB8NNNC: MLCC (1608) 0603 33pF 50VDC ±5% C0G (NP0); Manufacturer: Samsung Electro-Mechanics America, Inc; Supplier 1: OZDISAN; Manufacturer Part Number: CL10C330JB8NNNC
C19 C20 = T491B107K006AT: CAP.TANTAL 100uF 6.3V 10% B CASE (3528) SMD KEMET; Manufacturer: KEMET; Manufacturer Part Number: T491B107K006AT; Supplier 1: Ozdisan
C24 = CL10B153KB85PNC: MLCC (1608) 0603 15nF 50VDC ±10% X7R AUTOMOTIVE; Manufacturer: SAMSUNG; Supplier 1: OZDISAN; Manufacturer Part Number: CL10B153KB85PNC
C59 = CL10B103KB8NNNL: MLCC (1005) 0402 100pF 50VDC ±5% C0G (NP0); Manufacturer: YAGEO; Manufacturer Part Number: CC0402JRNPO9BN101
C60 = CL10B103KB8NNNL: MLCC (1005) 0402 100nF 16VDC ±10% X7R; Manufacturer: SAMSUNG; Manufacturer Part Number: CL05B104KO5NNNC
D3#1 = TPD4E1U06DBVR: DIODE TVS 45W 15V SOT23-6; Manufacturer: TEXAS; Value: *; Supplier 1: OZDISAN; Manufacturer Part Number: TPD4E1U06DBVR
D8#1 = LTST-C190TGKT: LED SMD 0603 GREEN 71-450mcd 130° WATER CLEAR; Manufacturer: LITEON; Package: 0603(1608 Metric); Manufacturer Part Number: LTST-C190TGKT; Value: GREEN
E1 = L-KLS1-SMA002-B: CONNECTOR ANTENNA SMA JACK R/A 50M; Manufacturer: KLS ELECTRONIC; Manufacturer Part Number: L-KLS1-SMA002-B; Supplier 1: OZDISAN
J?#1 = 115I-AEAA: Connector; Manufacturer_Name: ATTEND; Datasheet Link: https://www.attend.com.tw/data/download/file/115I-AEAA.pdf; Height: 1.52mm; Manufacturer_Part_Number: 115I-AEAA
L4 = CBC3225T100MR: INDUCTOR FIXED 0402 47nH 300mA SMD; Manufacturer: MURATA; Package: 0402 (1005 Metric); Manufacturer Part Number: LQG15HS47NJ02D
Q1 Q2#1 Q2#2 Q3 = BSS138W-7-F: MOSFET DIS.200mA 50V N-CH SC70-3; Manufacturer: DIODES; Value: *; Supplier 1: OZDISAN; Manufacturer Part Number: BSS138W-7-F
Q7 = PJA3439_R1_00001: MOSFET P-CH 60V 300mA SOT23 SMT; Manufacturer: Panjit International Inc.; Package: SOT23; Manufacturer Part Number: PJA3439_R1_00001; Supplier Part Number 1: 3757-PJA3439_R1_00001TR-ND; Supplier Part Number 2: 241-PJA3439_R1_00001; Supplier Part Number 3: PJA3439_R1_00001; Supplier 1: DIGIKEY; Supplier 2: MOUSER; Supplier 3: OZDISAN
Q12#1 = MMBTA42_R1_00001: TRANSISTOR DIS.500mA 300V NPN SOT23 GEN. SMT; Manufacturer: PANJIT; Package: SOT23; Supplier Part Number 1: 3757-MMBTA42_R1_00001CT-ND; Supplier Part Number 2: *; Supplier Part Number 3: MMBTA42_R1_00001; Supplier 1: DIGIKEY; Supplier 2: MOUSER; Supplier 3: OZDISAN; Manufacturer Part Number: MMBTA42_R1_00001
R12 = 0603SAF6801T5E: RES.(1608) 0603 6.8K Ohms 1% 1/10W-S 100PPM; Manufacturer: ROYALOHM; Supplier 1: Ozdisan; Manufacturer Part Number: 0603SAF6801T5E
R13 = 0603SAF1002T5E: RES.(1608) 0603 10K Ohms 1% 1/10W-S 100PPM; Manufacturer: ROYALOHM; Supplier 1: Ozdisan; Manufacturer Part Number: 0603SAF1002T5E
R14#1 = 0603SAF1001T5E: RES.(1608) 0603 1K Ohms 1% 1/10W-S 100PPM; Manufacturer: ROYALOHM; Supplier 1: Ozdisan; Manufacturer Part Number: 0603SAF1001T5E
R15#1 R16#1 R16#2 R16#4 R19 = 0603SAF4701T5E: RES.(1608) 0603 4.7K Ohms 1% 1/10W-S 100PPM; Manufacturer: ROYALOHM; Supplier 1: Ozdisan; Manufacturer Part Number: 0603SAF4701T5E
R16#3 = R03000: RES.(1005) 0402 10K Ohms 5% 1/16W 100PPM SMT; Manufacturer: YAGEO; Manufacturer Part Number: RC0402JR-0710KL
R17 R18#1 R18#2 R20#1 R22 = 0603SAF4702T5E: RES.(1608) 0603 47K Ohms 1% 1/10W-S 100PPM; Manufacturer: ROYALOHM; Supplier 1: Ozdisan; Manufacturer Part Number: 0603SAF4702T5E
R23 = 0603SAJ0153T5E: RES.(1608) 0603 15K Ohms 5% 1/10W-S 100PPM; Manufacturer: ROYALOHM; Supplier 1: Ozdisan; Manufacturer Part Number: 0603SAJ0153T5E
R24-R26 = 0603SAJ0220T5E: RES.(1608) 0603 22 Ohms 5% 1/10W-S 200PPM; Manufacturer: ROYALOHM; Supplier 1: Ozdisan; Manufacturer Part Number: 0603SAJ0220T5E
R88 = R02998: RES 0603 1K Ohms 1% 1/10W-S 100PPM; Manufacturer: ROYALOHM; Manufacturer Part Number: 0603SAF1001T5E
U5 = TXS0102DCUT: Voltage Level Translator Bidirectional 1 Circuit 2 Channel 24Mbps 8-VSSOP; Manufacturer: Texas Instruments; Value: *; Supplier 1: DIGIKEY; Manufacturer Part Number: TXS0102DCUT
U?#13 = EC25AFA-512-STD: Quectel EC25 is a series of 4G - LTE Cat 4 module optimized specially for M2M and IoT applications.; Availability: In Stock; Package: Custom Quectel; MP: EC25AFA-512-STD; SnapEDA_Link: https://www.snapeda.com/parts/EC25AFA-512-STD/Quectel/view-part/?ref=snap; MF: Quectel; Purchase-URL: https://pricing.snapeda.com/search/part/EC25AFA-512-STD/?ref=eda; Value: *; Check_prices: https://www.snapeda.com/parts/EC25AFA-512-STD/Quectel/view-part/?ref=eda; Price: None
U?#14 = ISL80113IRAJZ: Linear Voltage Regulator IC Positive Adjustable 1 Output 3A 10-DFN (3x3); Manufacturer: Renesas Electronics Corporation; Value: IC REG LINEAR POS ADJ 3A 10DFN; Supplier 1: DIGIKEY; Manufacturer Part Number: ISL80113IRAJZ